# EAGLE design PDU_v3.0 (EAGLE 9.6.2)

## Sheet 1 of 11: PC104 Header
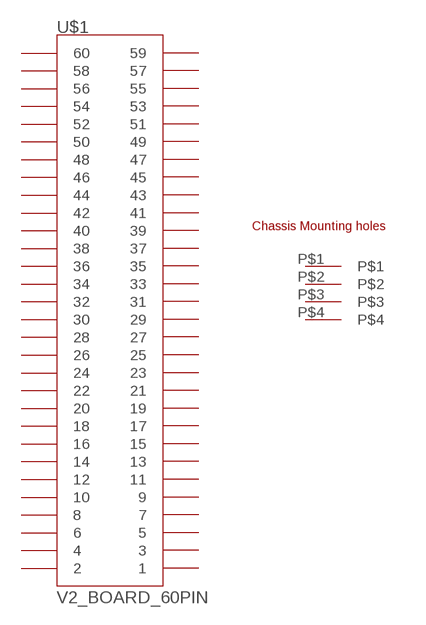
[diagram p0: schematic, sheet 1]

### Parts
U$1  V2_BOARD_60PIN  [PC104_WCONN_BACKPLANE_HEADER]
Unconnected: U$1.1 U$1.2 U$1.3 U$1.4 U$1.5 U$1.6 U$1.7 U$1.8 U$1.9 U$1.10 U$1.11 U$1.12 U$1.13 U$1.14 U$1.15 U$1.16 U$1.17 U$1.18 U$1.19 U$1.20 U$1.21 U$1.22 U$1.23 U$1.24 U$1.25 U$1.26 U$1.27 U$1.28 U$1.29 U$1.30 U$1.31 U$1.32 U$1.33 U$1.34 U$1.35 U$1.36 U$1.37 U$1.38 U$1.39 U$1.40 U$1.41 U$1.42 U$1.43 U$1.44 U$1.45 U$1.46 U$1.47 U$1.48 U$1.49 U$1.50 U$1.51 U$1.52 U$1.53 U$1.54 U$1.55 U$1.56 U$1.57 U$1.58 U$1.59 U$1.60 U$1.P$1 U$1.P$2 U$1.P$3 U$1.P$4

## Sheet 2 of 11: Connectors

## Sheet 3 of 11: H-Bridge Circuits
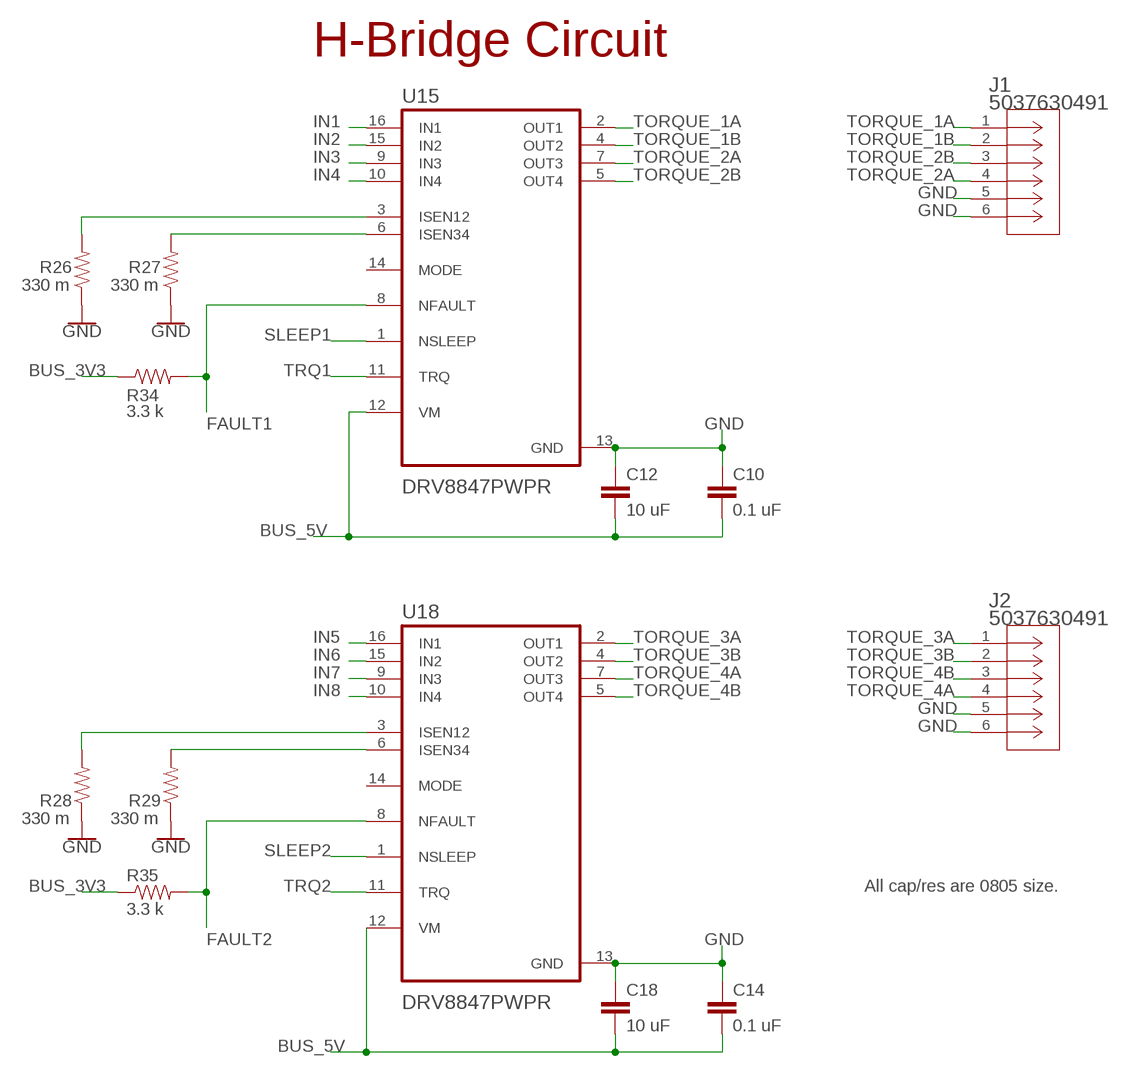
[diagram p1: schematic, sheet 3]

### Parts
C10  0.1 uF  CAP0805  [0805]
C12  10 uF  CAP0805  [0805]
C14  0.1 uF  CAP0805  [0805]
C18  10 uF  CAP0805  [0805]
J1  5037630491  [CON_5037630491]
J2  5037630491  [CON_5037630491]
R26  330 m  RESISTOR0805-RES  [0805]
R27  330 m  RESISTOR0805-RES  [0805]
R28  330 m  RESISTOR0805-RES  [0805]
R29  330 m  RESISTOR0805-RES  [0805]
R34  3.3 k  RESISTOR0805-RES  [0805]
R35  3.3 k  RESISTOR0805-RES  [0805]
U15  DRV8847PWPR  [SOP65P640X120-17N]
U18  DRV8847PWPR  [SOP65P640X120-17N]

### Nets
BUS_3V3: R34.1 R35.1 ; also sheet 4,6,8
BUS_5V: C10.2 C12.2 C14.2 C18.2 U15.12(VM) U18.12(VM) ; also sheet 4,6
FAULT1: R34.2 U15.8(NFAULT) ; also sheet 8
FAULT2: R35.2 U18.8(NFAULT) ; also sheet 8
GND: C10.1 C12.1 C14.1 C18.1 J1.5 J1.6 J2.5 J2.6 R26.1 R27.1 R28.1 R29.1 U15.13(GND) U18.13(GND) ; also sheet 4,5,6,7,8,9
IN1: U15.16(IN1) ; also sheet 8
IN2: U15.15(IN2) ; also sheet 8
IN3: U15.9(IN3) ; also sheet 8
IN4: U15.10(IN4) ; also sheet 8
IN5: U18.16(IN1) ; also sheet 8
IN6: U18.15(IN2) ; also sheet 8
IN7: U18.9(IN3) ; also sheet 8
IN8: U18.10(IN4) ; also sheet 8
N$20: R27.2 U15.6(ISEN34)
N$26: R26.2 U15.3(ISEN12)
N$30: R29.2 U18.6(ISEN34)
N$31: R28.2 U18.3(ISEN12)
SLEEP1: U15.1(NSLEEP) ; also sheet 8
SLEEP2: U18.1(NSLEEP) ; also sheet 8
TORQUE_1A: J1.1 U15.2(OUT1)
TORQUE_1B: J1.2 U15.4(OUT2)
TORQUE_2A: J1.4 U15.7(OUT3)
TORQUE_2B: J1.3 U15.5(OUT4)
TORQUE_3A: J2.1 U18.2(OUT1)
TORQUE_3B: J2.2 U18.4(OUT2)
TORQUE_4A: J2.4 U18.7(OUT3)
TORQUE_4B: J2.3 U18.5(OUT4)
TRQ1: U15.11(TRQ) ; also sheet 8
TRQ2: U18.11(TRQ) ; also sheet 8
Unconnected: U15.14(MODE) U18.14(MODE)

### Notes on the sheet
- H-Bridge Circuit
- All cap/res are 0805 size.

## Sheet 4 of 11: Switches 1
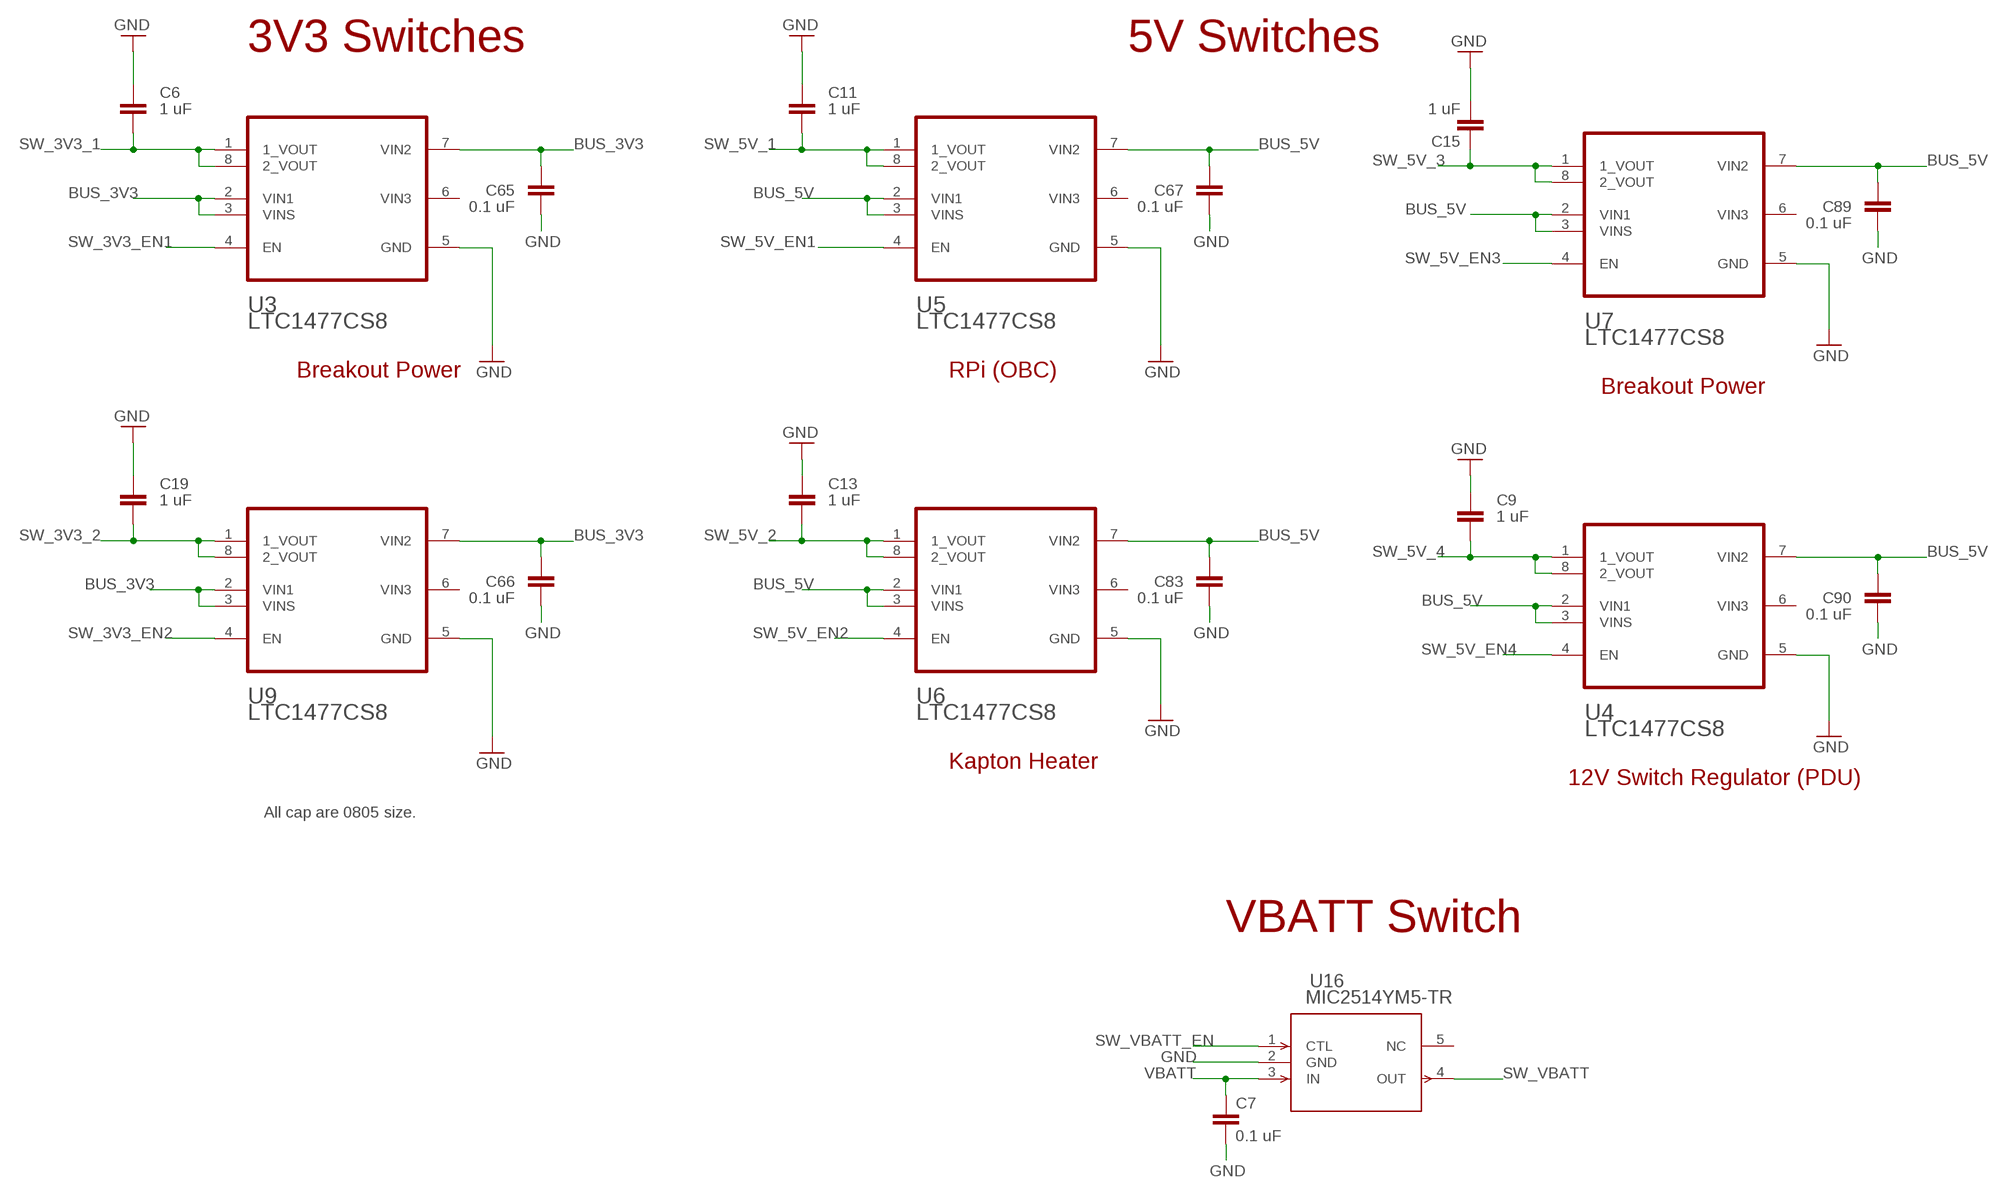
[diagram p2: schematic, sheet 4]

### Parts
C6  1 uF  CAP0805  [0805]
C7  0.1 uF  CAP0805  [0805]
C9  1 uF  CAP0805  [0805]
C11  1 uF  CAP0805  [0805]
C13  1 uF  CAP0805  [0805]
C15  1 uF  CAP0805  [0805]
C19  1 uF  CAP0805  [0805]
C65  0.1 uF  CAP0805  [0805]
C66  0.1 uF  CAP0805  [0805]
C67  0.1 uF  CAP0805  [0805]
C83  0.1 uF  CAP0805  [0805]
C89  0.1 uF  CAP0805  [0805]
C90  0.1 uF  CAP0805  [0805]
U3  LTC1477CS8LINEAR_TECHNOLOGY_LTC1477CS8_0_2  [LINEAR_TECHNOLOGY_LTC1477CS8_2]
U4  LTC1477CS8LINEAR_TECHNOLOGY_LTC1477CS8_0_2  [LINEAR_TECHNOLOGY_LTC1477CS8_2]
U5  LTC1477CS8LINEAR_TECHNOLOGY_LTC1477CS8_0_2  [LINEAR_TECHNOLOGY_LTC1477CS8_2]
U6  LTC1477CS8LINEAR_TECHNOLOGY_LTC1477CS8_0_2  [LINEAR_TECHNOLOGY_LTC1477CS8_2]
U7  LTC1477CS8LINEAR_TECHNOLOGY_LTC1477CS8_0_2  [LINEAR_TECHNOLOGY_LTC1477CS8_2]
U9  LTC1477CS8LINEAR_TECHNOLOGY_LTC1477CS8_0_2  [LINEAR_TECHNOLOGY_LTC1477CS8_2]
U16  MIC2514YM5-TR  [SOT-23-5_M5_MCH]

### Nets
BUS_3V3: C65.1 C66.1 U3.2(VIN1) U3.3(VINS) U3.7(VIN2) U9.2(VIN1) U9.3(VINS) U9.7(VIN2) ; also sheet 3,6,8
BUS_5V: C67.1 C83.1 C89.1 C90.1 U4.2(VIN1) U4.3(VINS) U4.7(VIN2) U5.2(VIN1) U5.3(VINS) U5.7(VIN2) U6.2(VIN1) U6.3(VINS) U6.7(VIN2) U7.2(VIN1) U7.3(VINS) U7.7(VIN2) ; also sheet 3,6
GND: C6.2 C7.2 C9.2 C11.2 C13.2 C15.2 C19.2 C65.2 C66.2 C67.2 C83.2 C89.2 C90.2 U3.5(GND) U4.5(GND) U5.5(GND) U6.5(GND) U7.5(GND) U9.5(GND) U16.2(GND) ; also sheet 3,5,6,7,8,9
SW_3V3_1: C6.1 U3.1(1_VOUT) U3.8(2_VOUT)
SW_3V3_2: C19.1 U9.1(1_VOUT) U9.8(2_VOUT)
SW_3V3_EN1: U3.4(EN) ; also sheet 8
SW_3V3_EN2: U9.4(EN) ; also sheet 8
SW_5V_1: C11.1 U5.1(1_VOUT) U5.8(2_VOUT)
SW_5V_2: C13.1 U6.1(1_VOUT) U6.8(2_VOUT)
SW_5V_3: C15.1 U7.1(1_VOUT) U7.8(2_VOUT)
SW_5V_4: C9.1 U4.1(1_VOUT) U4.8(2_VOUT) ; also sheet 5
SW_5V_EN1: U5.4(EN) ; also sheet 8
SW_5V_EN2: U6.4(EN) ; also sheet 8
SW_5V_EN3: U7.4(EN) ; also sheet 8
SW_5V_EN4: U4.4(EN) ; also sheet 8
SW_VBATT: U16.4(OUT)
SW_VBATT_EN: U16.1(CTL) ; also sheet 8
VBATT: C7.1 U16.3(IN) ; also sheet 6,7,8
Unconnected: U16.5(NC)

### Notes on the sheet
- 3V3 Switches | 5V Switches
- Breakout Power | RPi (OBC)
- Breakout Power
- Kapton Heater
- 12V Switch Regulator (PDU)
- All cap are 0805 size.
- VBATT Switch
- Switches (3V3, 5V, VBATT)

## Sheet 5 of 11: Switches 2
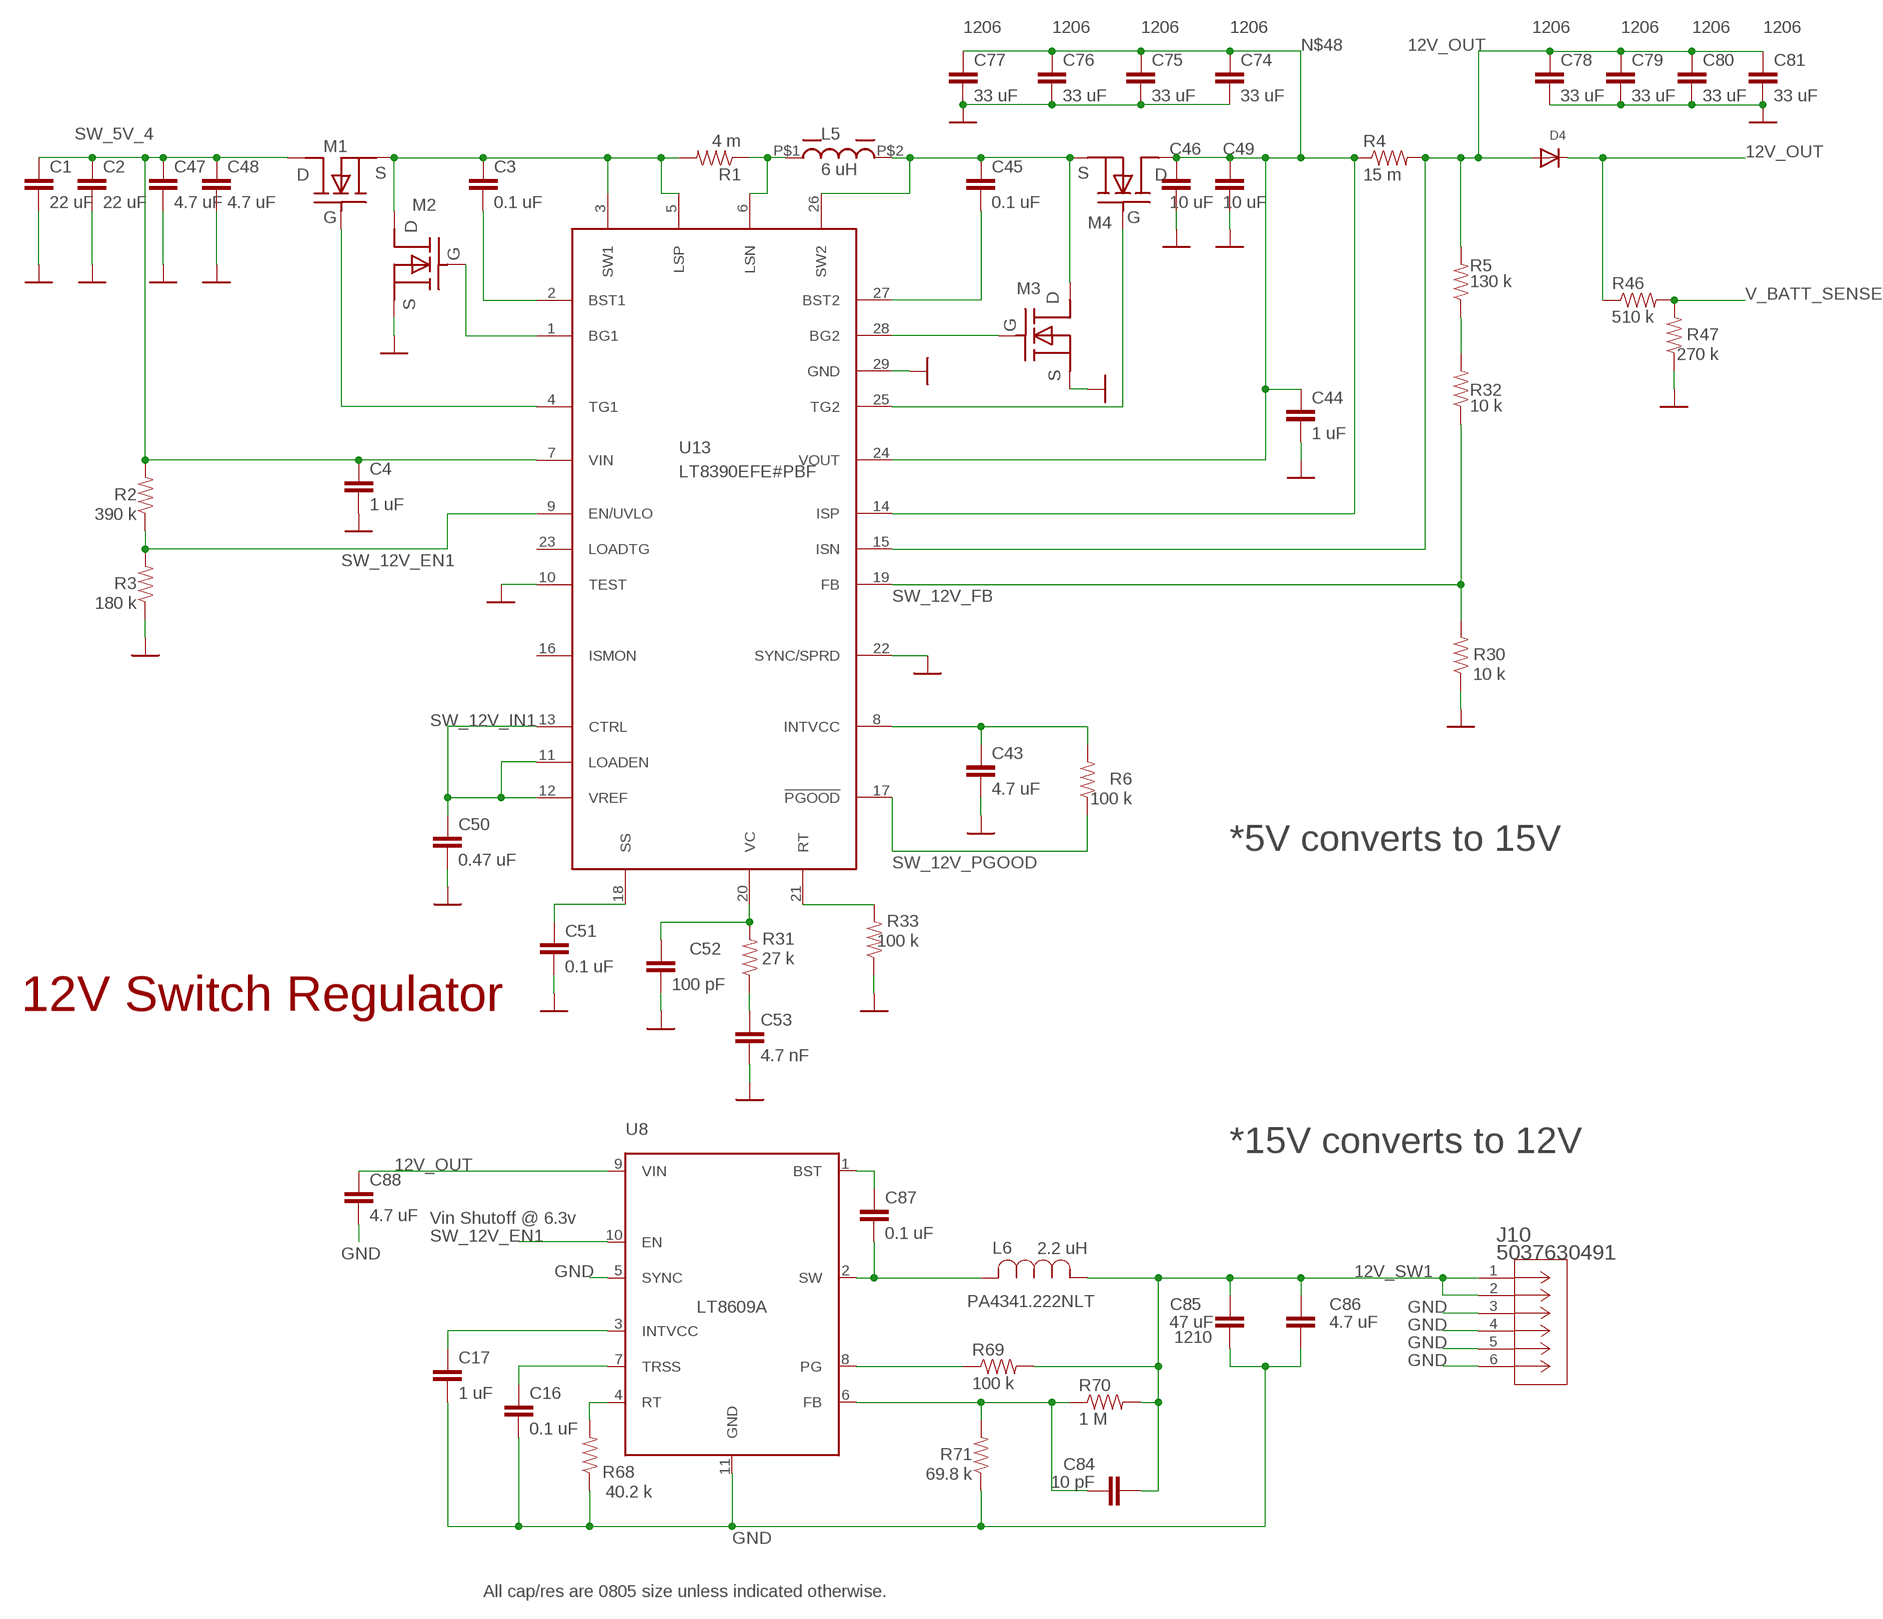
[diagram p3: schematic, sheet 5]

### Parts
C1  22 uF  CAP0805  [0805]
C2  22 uF  CAP0805  [0805]
C3  0.1 uF  CAP0805  [0805]
C4  1 uF  CAP0805  [0805]
C16  0.1 uF  CAP0805  [0805]
C17  1 uF  CAP0805  [0805]
C43  4.7 uF  CAP0805  [0805]
C44  1 uF  CAP0805  [0805]
C45  0.1 uF  CAP0805  [0805]
C46  10 uF  CAP0805  [0805]
C47  4.7 uF  CAP0805  [0805]
C48  4.7 uF  CAP0805  [0805]
C49  10 uF  CAP0805  [0805]
C50  0.47 uF  CAP0805  [0805]
C51  0.1 uF  CAP0805  [0805]
C52  100 pF  CAP0805  [0805]
C53  4.7 nF  CAP0805  [0805]
C74  33 uF  CAP1206  [1206]
C75  33 uF  CAP1206  [1206]
C76  33 uF  CAP1206  [1206]
C77  33 uF  CAP1206  [1206]
C78  33 uF  CAP1206  [1206]
C79  33 uF  CAP1206  [1206]
C80  33 uF  CAP1206  [1206]
C81  33 uF  CAP1206  [1206]
C84  10 pF  CAP0805  [0805]
C85  47 uF  CAP1210  [1210]
C86  4.7 uF  CAP0805  [0805]
C87  0.1 uF  CAP0805  [0805]
C88  4.7 uF  CAP0805  [0805]
D4  DIODE_SOD-123FL  [SOD-123FL]
J10  5037630491  [CON_5037630491]
L5  6 uH  7443551600  [7443551600]
L6  PA4341.222NLT  [IND_222NLT_PUL]
M1  BSZ100N06LS3  [BSZ100N06LS3]
M2  BSZ100N06LS3  [BSZ100N06LS3]
M3  BSZ033NE2LS5  BSZ100N06LS3  [BSZ100N06LS3]
M4  BSZ033NE2LS5  BSZ100N06LS3  [BSZ100N06LS3]
R1  4 m  RESISTOR0805-RES  [0805]
R2  390 k  RESISTOR0805-RES  [0805]
R3  180 k  RESISTOR0805-RES  [0805]
R4  15 m  RESISTOR0805-RES  [0805]
R5  130 k  RESISTOR0805-RES  [0805]
R6  100 k  RESISTOR0805-RES  [0805]
R30  10 k  RESISTOR0805-RES  [0805]
R31  27 k  RESISTOR0805-RES  [0805]
R32  10 k  RESISTOR0805-RES  [0805]
R33  100 k  RESISTOR0805-RES  [0805]
R46  510 k  RESISTOR0805-RES  [0805]
R47  270 k  RESISTOR0805-RES  [0805]
R68  40.2 k  RESISTOR0805-RES  [0805]
R69  100 k  RESISTOR0805-RES  [0805]
R70  1 M  RESISTOR0805-RES  [0805]
R71  69.8 k  RESISTOR0805-RES  [0805]
U8  LT8609A  [MSOP-10_MSE]
U13  LT8390EFE#PBF  [SOP65P640X120-29N]

### Nets
12V_OUT: C78.1 C79.1 C80.1 C81.1 C88.1 D4.A D4.C R4.2 R5.2 R46.1 U8.9(VIN) U13.15(ISN)
12V_SW1: C84.2 C85.1 C86.1 J10.1 J10.2 L6.1 R69.2 R70.2
BST_3V3_BUS: C87.1 U8.1(BST)
FB_3V3_BUS: C84.1 R70.1 R71.2 U8.6(FB)
GND: C1.2 C2.2 C4.2 C16.2 C17.2 C43.2 C44.2 C46.2 C47.2 C48.2 C49.2 C50.2 C51.2 C52.2 C53.2 C74.2 C75.2 C76.2 C77.2 C78.2 C79.2 C80.2 C81.2 C85.2 C86.2 C88.2 J10.3 J10.4 J10.5 J10.6 M2.P$2(S) M2.P$3(S) M2.P$4(S) M3.P$2(S) M3.P$3(S) M3.P$4(S) R3.1 R30.1 R33.1 R47.1 R68.1 R71.1 U8.5(SYNC) U8.11(GND) U13.10(TEST) U13.22(SYNC/SPRD) U13.29(GND) ; also sheet 3,4,6,7,8,9
N$1: C3.1 M1.P$2(S) M1.P$3(S) M1.P$4(S) M2.P$5(D) M2.P$6(D) M2.P$7(D) M2.P$8(D) M2.P$9(D) R1.2 U13.3(SW1) U13.5(LSP)
N$2: C3.2 U13.2(BST1)
N$3: M2.P$1(G) U13.1(BG1)
N$4: M1.P$1(G) U13.4(TG1)
N$6: M3.P$1(G) U13.28(BG2)
N$38: C52.1 R31.2 U13.20(VC)
N$40: R5.1 R32.2
N$41: C45.1 L5.P$2 M3.P$5(D) M3.P$6(D) M3.P$7(D) M3.P$8(D) M3.P$9(D) M4.P$2(S) M4.P$3(S) M4.P$4(S) U13.26(SW2)
N$44: C43.1 R6.2 U13.8(INTVCC)
N$45: L5.P$1 R1.1 U13.6(LSN)
N$47: C45.2 U13.27(BST2)
N$48: C44.1 C46.1 C49.1 C74.1 C75.1 C76.1 C77.1 M4.P$5(D) M4.P$6(D) M4.P$7(D) M4.P$8(D) M4.P$9(D) R4.1 U13.14(ISP) U13.24(VOUT)
N$49: M4.P$1(G) U13.25(TG2)
N$50: C51.1 U13.18(SS)
N$52: R33.2 U13.21(RT)
N$55: C53.1 R31.1
PG_3V3_BUS: R69.1 U8.8(PG)
RT_3V3_BUS: R68.2 U8.4(RT)
SW_3V3_BUS: C87.2 L6.2 U8.2(SW)
SW_5V_4: C1.1 C2.1 C4.1 C47.1 C48.1 M1.P$5(D) M1.P$6(D) M1.P$7(D) M1.P$8(D) M1.P$9(D) R2.2 U13.7(VIN) ; also sheet 4
SW_12V_EN1: R2.1 R3.2 U8.10(EN) U13.9(EN/UVLO)
SW_12V_FB: R30.2 R32.1 U13.19(FB)
SW_12V_IN1: C50.1 U13.11(LOADEN) U13.12(VREF) U13.13(CTRL)
SW_12V_PGOOD: R6.1 U13.17(!PGOOD)
TRSS_3V3_BUS: C16.1 U8.7(TRSS)
V_BATT_SENSE: R46.2 R47.2
VCC_3V3_BUS: C17.1 U8.3(INTVCC)
Unconnected: U13.16(ISMON) U13.23(LOADTG)

### Notes on the sheet
- 1206 | 1206 | 1206 | 1206 | 1206 | 1206 | 1206 | 1206
- 6 uH
- *5V converts to 15V
- 12V Switch Regulator
- *15V converts to 12V
- Vin Shutoff @ 6.3v
- 2.2 uH
- 1210
- All cap/res are 0805 size unless indicated otherwise.

## Sheet 6 of 11: Bus (3V3, 5V)
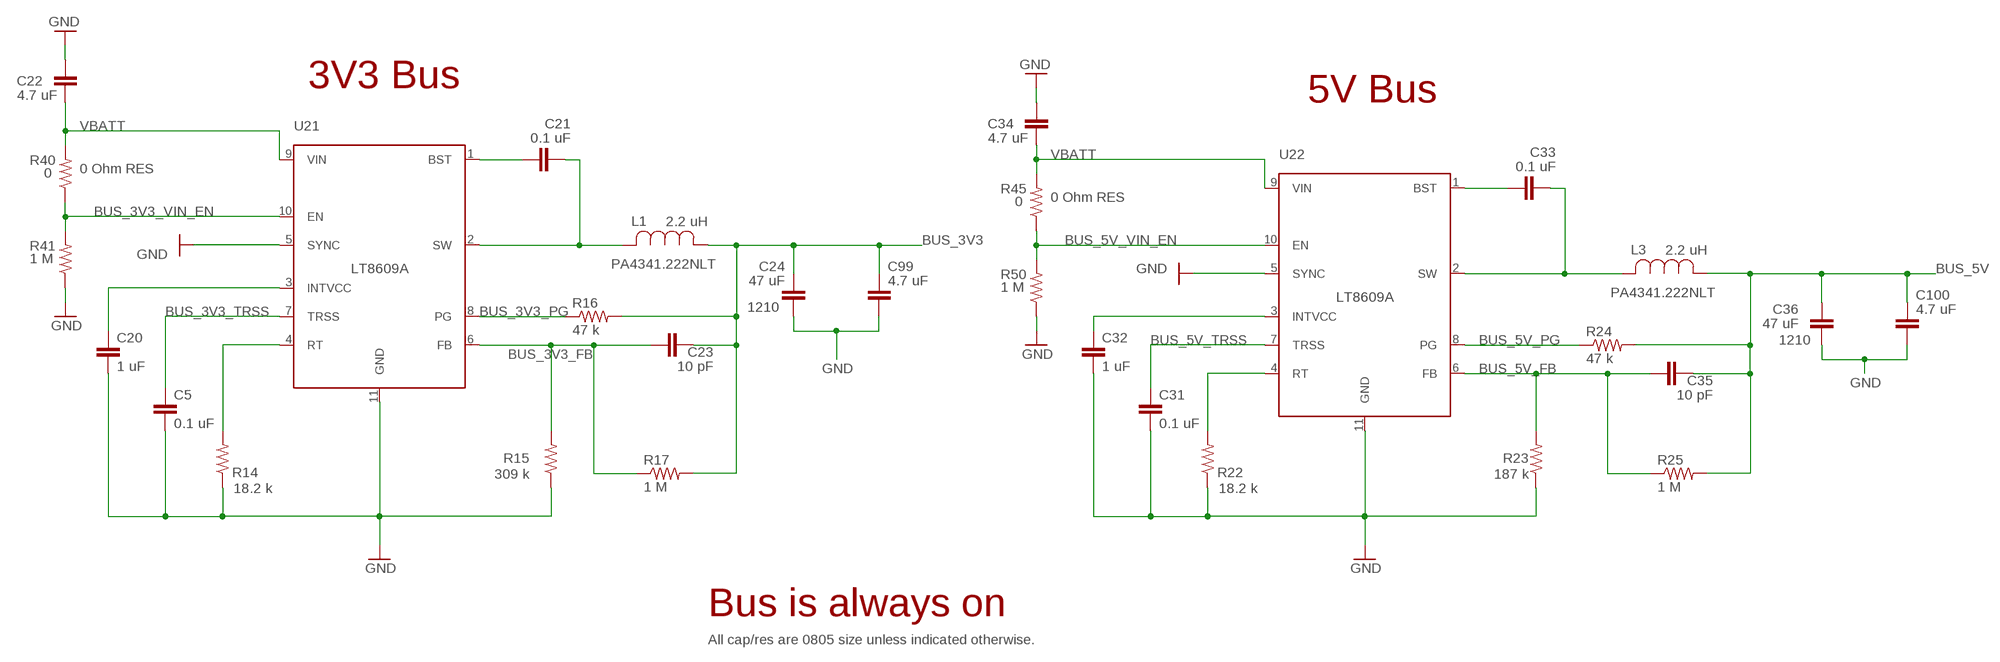
[diagram p4: schematic, sheet 6]

### Parts
C5  0.1 uF  CAP0805  [0805]
C20  1 uF  CAP0805  [0805]
C21  0.1 uF  CAP0805  [0805]
C22  4.7 uF  CAP0805  [0805]
C23  10 pF  CAP0805  [0805]
C24  47 uF  CAP1210  [1210]
C31  0.1 uF  CAP0805  [0805]
C32  1 uF  CAP0805  [0805]
C33  0.1 uF  CAP0805  [0805]
C34  4.7 uF  CAP0805  [0805]
C35  10 pF  CAP0805  [0805]
C36  47 uF  CAP1210  [1210]
C99  4.7 uF  CAP0805  [0805]
C100  4.7 uF  CAP0805  [0805]
L1  PA4341.222NLT  [IND_222NLT_PUL]
L3  PA4341.222NLT  [IND_222NLT_PUL]
R14  18.2 k  RESISTOR0805-RES  [0805]
R15  309 k  RESISTOR0805-RES  [0805]
R16  47 k  RESISTOR0805-RES  [0805]
R17  1 M  RESISTOR0805-RES  [0805]
R22  18.2 k  RESISTOR0805-RES  [0805]
R23  187 k  RESISTOR0805-RES  [0805]
R24  47 k  RESISTOR0805-RES  [0805]
R25  1 M  RESISTOR0805-RES  [0805]
R40  0  RESISTOR0805-RES  [0805]
R41  1 M  RESISTOR0805-RES  [0805]
R45  0  RESISTOR0805-RES  [0805]
R50  1 M  RESISTOR0805-RES  [0805]
U21  LT8609A  [MSOP-10_MSE]
U22  LT8609A  [MSOP-10_MSE]

### Nets
BUS_3V3: C23.2 C24.1 C99.1 L1.1 R16.2 R17.2 ; also sheet 3,4,8
BUS_3V3_FB: C23.1 R15.2 R17.1 U21.6(FB)
BUS_3V3_PG: R16.1 U21.8(PG)
BUS_3V3_TRSS: C5.1 U21.7(TRSS)
BUS_3V3_VIN_EN: R40.1 R41.2 U21.10(EN)
BUS_5V: C35.2 C36.1 C100.1 L3.1 R24.2 R25.2 ; also sheet 3,4
BUS_5V_FB: C35.1 R23.2 R25.1 U22.6(FB)
BUS_5V_PG: R24.1 U22.8(PG)
BUS_5V_TRSS: C31.1 U22.7(TRSS)
BUS_5V_VIN_EN: R45.1 R50.2 U22.10(EN)
GND: C5.2 C20.2 C22.2 C24.2 C31.2 C32.2 C34.2 C36.2 C99.2 C100.2 R14.1 R15.1 R22.1 R23.1 R41.1 R50.1 U21.5(SYNC) U21.11(GND) U22.5(SYNC) U22.11(GND) ; also sheet 3,4,5,7,8,9
N$7: C20.1 U21.3(INTVCC)
N$8: R14.2 U21.4(RT)
N$11: C21.1 U21.1(BST)
N$12: C21.2 L1.2 U21.2(SW)
N$25: R22.2 U22.4(RT)
N$27: C32.1 U22.3(INTVCC)
N$28: C33.1 U22.1(BST)
N$29: C33.2 L3.2 U22.2(SW)
VBATT: C22.1 C34.1 R40.2 R45.2 U21.9(VIN) U22.9(VIN) ; also sheet 4,7,8

### Notes on the sheet
- 3V3 Bus
- 5V Bus
- 0 Ohm RES
- 0 Ohm RES
- 2.2 uH
- 2.2 uH
- 1210
- 1210
- Bus is always on
- All cap/res are 0805 size unless indicated otherwise.

## Sheet 7 of 11: 5V Burn
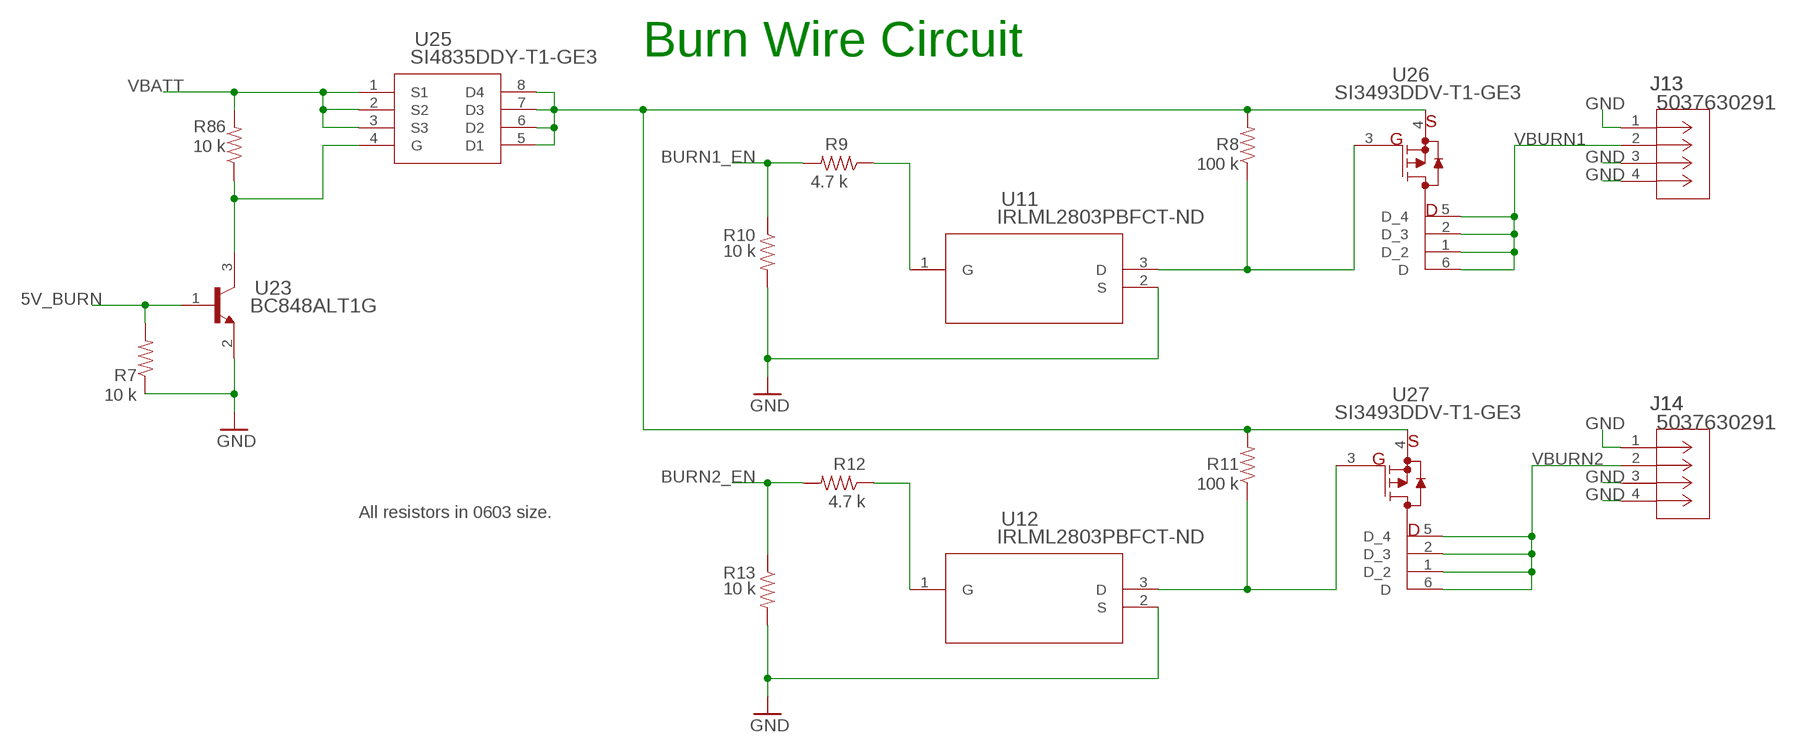
[diagram p5: schematic, sheet 7]

### Parts
J13  5037630291  [CON_5037630291]
J14  5037630291  [CON_5037630291]
R7  10 k  RESISTOR0603-RES  [0603-RES]
R8  100 k  RESISTOR0603-RES  [0603-RES]
R9  4.7 k  RESISTOR0603-RES  [0603-RES]
R10  10 k  RESISTOR0603-RES  [0603-RES]
R11  100 k  RESISTOR0603-RES  [0603-RES]
R12  4.7 k  RESISTOR0603-RES  [0603-RES]
R13  10 k  RESISTOR0603-RES  [0603-RES]
R86  10 k  RESISTOR0603-RES  [0603-RES]
U11  IRLML2803PBFCT-ND  [PG-TO23-3_INF]
U12  IRLML2803PBFCT-ND  [PG-TO23-3_INF]
U23  BC848ALT1G  [SOT-23_ONS]
U25  SI4835DDY-T1-GE3  [SOIC_DY-T1-GE3_VIS]
U26  SI3493DDV-T1-GE3  [6TSOP_VIS]
U27  SI3493DDV-T1-GE3  [6TSOP_VIS]

### Nets
5V_BURN: R7.2 U23.1(BASE) ; also sheet 8
BURN1_EN: R9.2 R10.1 ; also sheet 8
BURN2_EN: R12.2 R13.1 ; also sheet 8
GND: J13.1 J13.3 J13.4 J14.1 J14.3 J14.4 R7.1 R10.2 R13.2 U11.2(S) U12.2(S) U23.2(EMITTER) ; also sheet 3,4,5,6,8,9
N$13: R8.2 R11.2 U25.5(D1) U25.6(D2) U25.7(D3) U25.8(D4) U26.4(S) U27.4(S)
N$14: R12.1 U12.1(G)
N$15: R11.1 U12.3(D) U27.3(G)
N$16: R86.1 U23.3(COLLECTOR) U25.4(G)
N$17: R9.1 U11.1(G)
N$18: R8.1 U11.3(D) U26.3(G)
VBATT: R86.2 U25.1(S1) U25.2(S2) U25.3(S3) ; also sheet 4,6,8
VBURN1: J13.2 U26.1(D_2) U26.2(D_3) U26.5(D_4) U26.6(D)
VBURN2: J14.2 U27.1(D_2) U27.2(D_3) U27.5(D_4) U27.6(D)

### Notes on the sheet
- Burn Wire Circuit
- All resistors in 0603 size.

## Sheet 8 of 11: Microprocessor
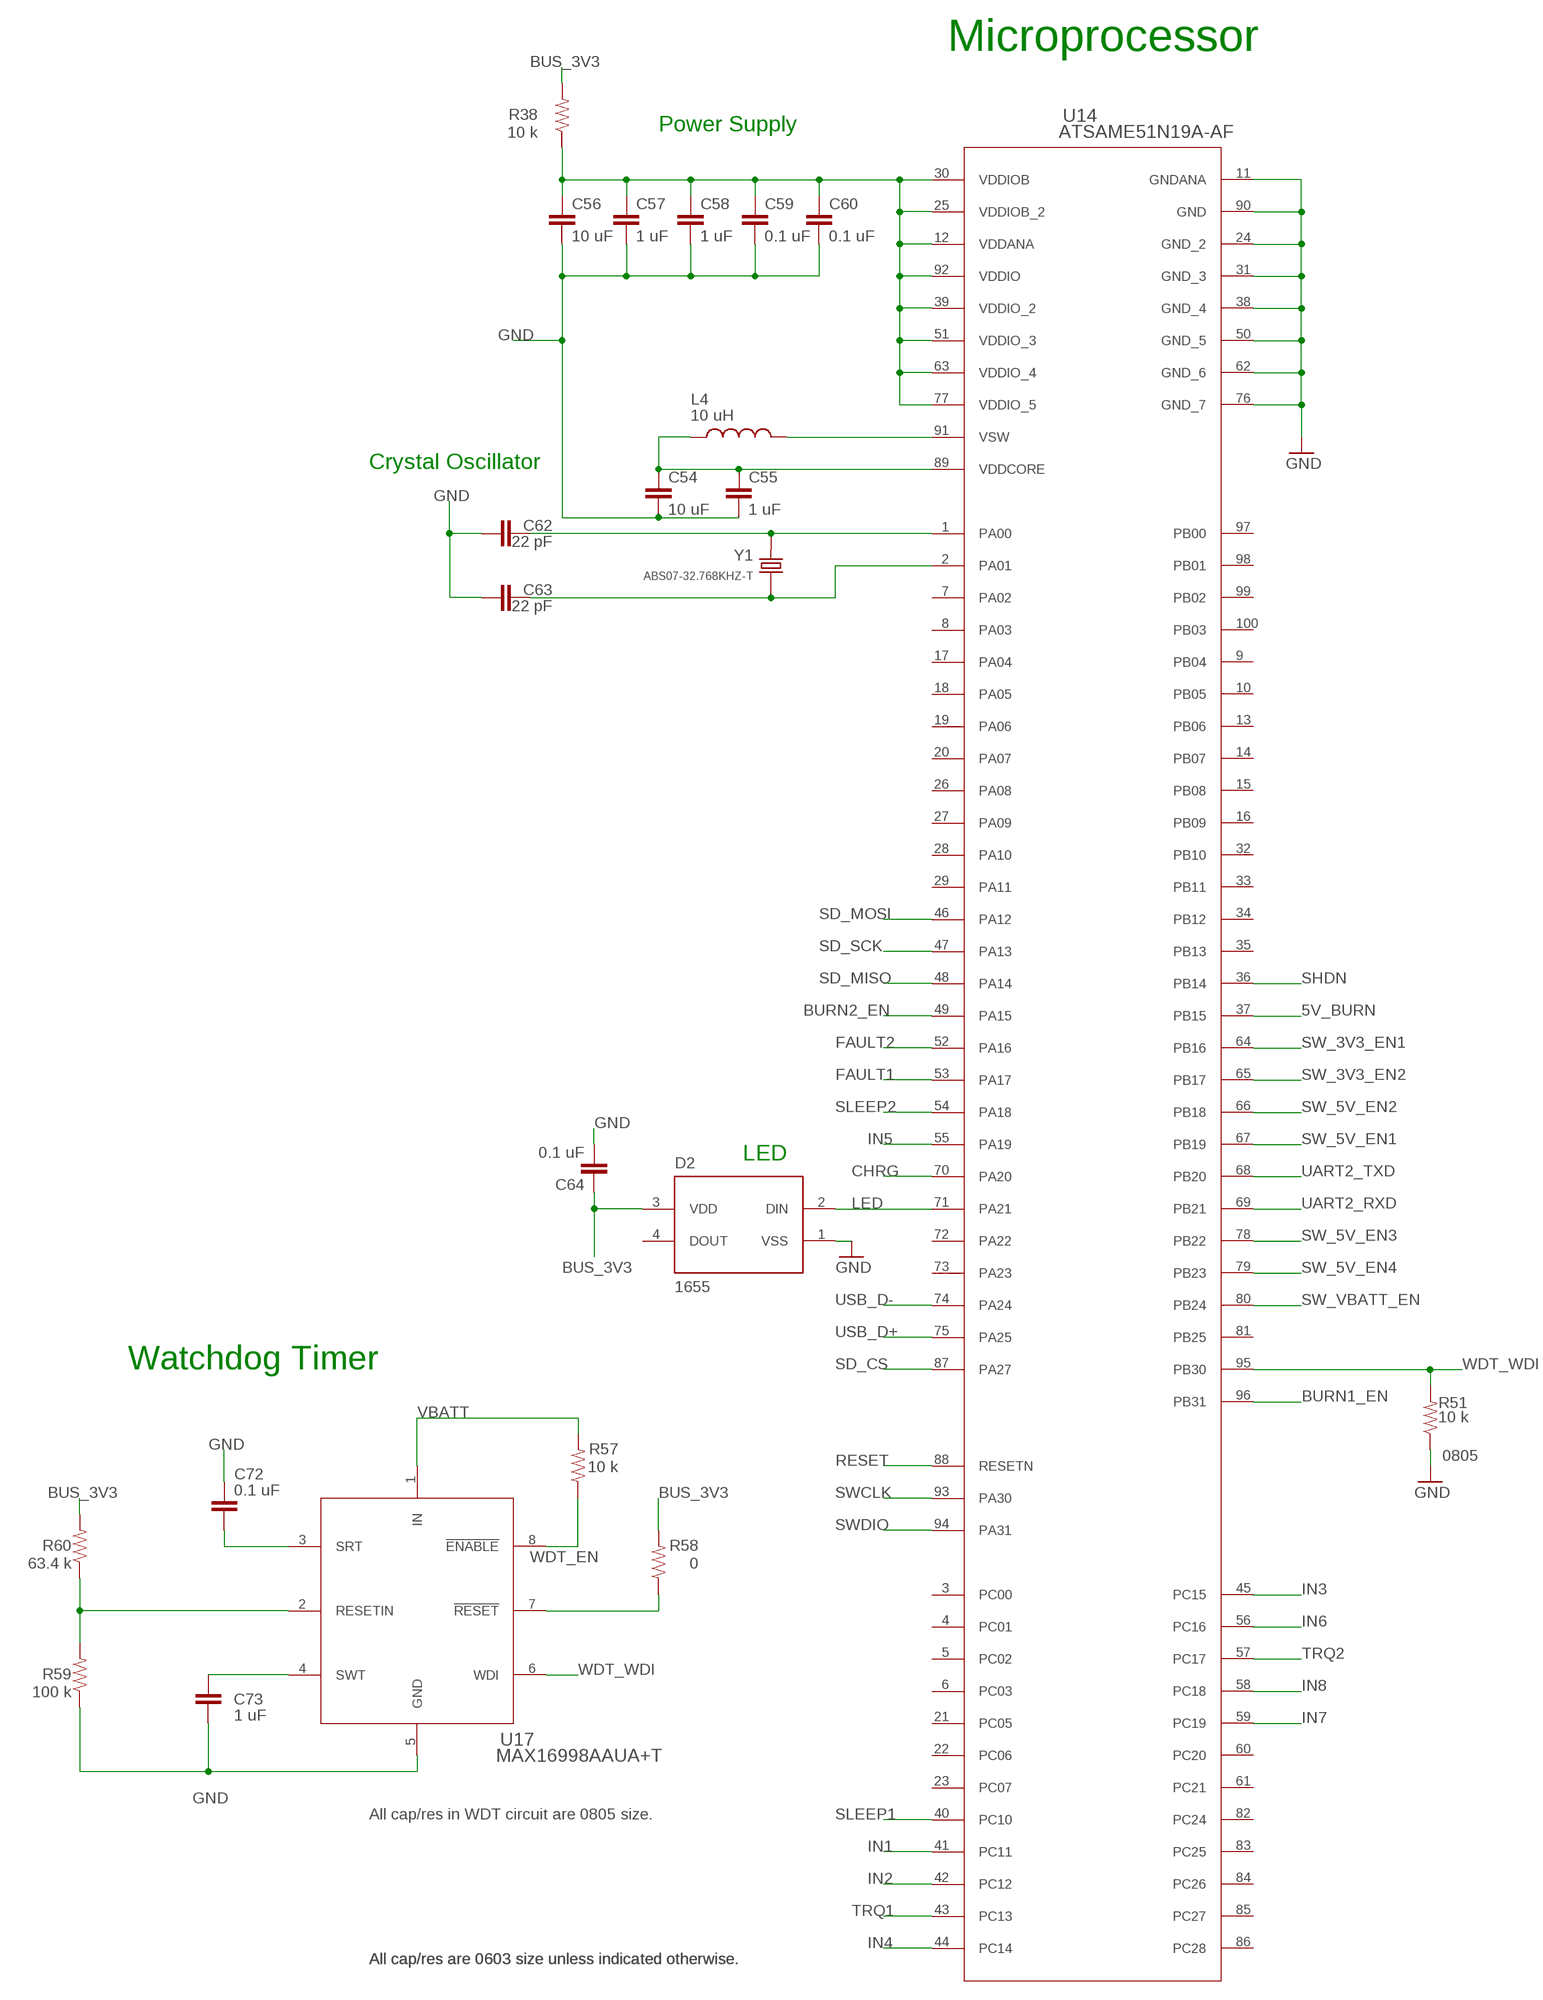
[diagram p6: schematic, sheet 8]

### Parts
C54  10 uF  CAP0603-CAP  [0603-CAP]
C55  1 uF  CAP0603-CAP  [0603-CAP]
C56  10 uF  CAP0603-CAP  [0603-CAP]
C57  1 uF  CAP0603-CAP  [0603-CAP]
C58  1 uF  CAP0603-CAP  [0603-CAP]
C59  0.1 uF  CAP0603-CAP  [0603-CAP]
C60  0.1 uF  CAP0603-CAP  [0603-CAP]
C62  22 pF  CAP0603-CAP  [0603-CAP]
C63  22 pF  CAP0603-CAP  [0603-CAP]
C64  0.1 uF  CAP0603-CAP  [0603-CAP]
C72  0.1 uF  CAP0805  [0805]
C73  1 uF  CAP0805  [0805]
D2  1655  [LED_1655]
L4  10 uH  CBL2012T100M  [INDC2012X100N]
R38  10 k  RESISTOR0603-RES  [0603-RES]
R51  10 k  RESISTOR0805-RES  [0805]
R57  10 k  RESISTOR0805-RES  [0805]
R58  0  RESISTOR0805-RES  [0805]
R59  100 k  RESISTOR0805-RES  [0805]
R60  63.4 k  RESISTOR0805-RES  [0805]
U14  ATSAME51N19A-AF  [TQFP100_14X14MC_MCH]
U17  MAX16998AAUA+T  [21-0036K_MXM]
Y1  ABS07-32.768KHZ-T  [XTAL_ABS07-32.768KHZ-T]

### Nets
5V_BURN: U14.37(PB15) ; also sheet 7
BURN1_EN: U14.96(PB31) ; also sheet 7
BURN2_EN: U14.49(PA15) ; also sheet 7
BUS_3V3: C64.1 D2.3(VDD) R38.2 R58.2 R60.2 ; also sheet 3,4,6
CCO_0: C62.2 U14.1(PA00) Y1.2
CCO_1: C63.2 U14.2(PA01) Y1.1
CHRG: U14.70(PA20)
FAULT1: U14.53(PA17) ; also sheet 3
FAULT2: U14.52(PA16) ; also sheet 3
GND: C54.2 C55.2 C56.2 C57.2 C58.2 C59.2 C60.2 C62.1 C63.1 C64.2 C72.1 C73.2 D2.1(VSS) R51.1 R59.1 U14.11(GNDANA) U14.24(GND_2) U14.31(GND_3) U14.38(GND_4) U14.50(GND_5) U14.62(GND_6) U14.76(GND_7) U14.90(GND) U17.5(GND) ; also sheet 3,4,5,6,7,9
IN1: U14.41(PC11) ; also sheet 3
IN2: U14.42(PC12) ; also sheet 3
IN3: U14.45(PC15) ; also sheet 3
IN4: U14.44(PC14) ; also sheet 3
IN5: U14.55(PA19) ; also sheet 3
IN6: U14.56(PC16) ; also sheet 3
IN7: U14.59(PC19) ; also sheet 3
IN8: U14.58(PC18) ; also sheet 3
LED: D2.2(DIN) U14.71(PA21)
N$46: L4.2 U14.91(VSW)
N$58: C54.1 C55.1 L4.1 U14.89(VDDCORE)
N$66: C72.2 U17.3(SRT)
N$68: C73.1 U17.4(SWT)
N$70: R59.2 R60.1 U17.2(RESETIN)
RESET: R58.1 U14.88(RESETN) U17.7(!RESET)
SD_CS: U14.87(PA27)
SD_MISO: U14.48(PA14)
SD_MOSI: U14.46(PA12)
SD_SCK: U14.47(PA13)
SHDN: U14.36(PB14)
SLEEP1: U14.40(PC10) ; also sheet 3
SLEEP2: U14.54(PA18) ; also sheet 3
SW_3V3_EN1: U14.64(PB16) ; also sheet 4
SW_3V3_EN2: U14.65(PB17) ; also sheet 4
SW_5V_EN1: U14.67(PB19) ; also sheet 4
SW_5V_EN2: U14.66(PB18) ; also sheet 4
SW_5V_EN3: U14.78(PB22) ; also sheet 4
SW_5V_EN4: U14.79(PB23) ; also sheet 4
SW_VBATT_EN: U14.80(PB24) ; also sheet 4
SWCLK: U14.93(PA30)
SWDIO: U14.94(PA31)
TRQ1: U14.43(PC13) ; also sheet 3
TRQ2: U14.57(PC17) ; also sheet 3
UART2_RXD: U14.69(PB21)
UART2_TXD: U14.68(PB20)
USB_D+: U14.75(PA25)
USB_D-: U14.74(PA24)
VBATT: R57.2 U17.1(IN) ; also sheet 4,6,7
VDD1: C56.1 C57.1 C58.1 C59.1 C60.1 R38.1 U14.12(VDDANA) U14.25(VDDIOB_2) U14.30(VDDIOB) U14.39(VDDIO_2) U14.51(VDDIO_3) U14.63(VDDIO_4) U14.77(VDDIO_5) U14.92(VDDIO)
WDT_EN: R57.1 U17.8(!ENABLE)
WDT_WDI: R51.2 U14.95(PB30) U17.6(WDI)
Unconnected: D2.4(DOUT) U14.3(PC00) U14.4(PC01) U14.5(PC02) U14.6(PC03) U14.7(PA02) U14.8(PA03) U14.9(PB04) U14.10(PB05) U14.13(PB06) U14.14(PB07) U14.15(PB08) U14.16(PB09) U14.17(PA04) U14.18(PA05) U14.19(PA06) U14.20(PA07) U14.21(PC05) U14.22(PC06) U14.23(PC07) U14.26(PA08) U14.27(PA09) U14.28(PA10) U14.29(PA11) U14.32(PB10) U14.33(PB11) U14.34(PB12) U14.35(PB13) U14.60(PC20) U14.61(PC21) U14.72(PA22) U14.73(PA23) U14.81(PB25) U14.82(PC24) U14.83(PC25) U14.84(PC26) U14.85(PC27) U14.86(PC28) U14.97(PB00) U14.98(PB01) U14.99(PB02) U14.100(PB03)

### Notes on the sheet
- Microprocessor
- Power Supply
- Crystal Oscillator
- LED
- Watchdog Timer
- 0805
- All cap/res in WDT circuit are 0805 size.
- All cap/res are 0603 size unless indicated otherwise. | All cap/res are 0603 size unless indicated otherwise.

## Sheet 9 of 11: Sensors (Current, Temperature)
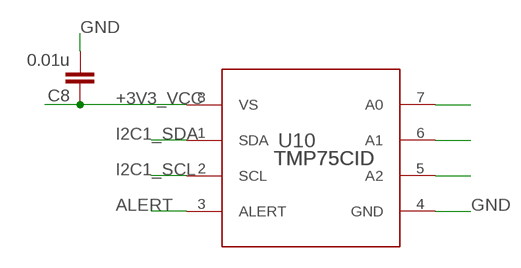
[diagram p7: schematic, sheet 9]

### Parts
C8  0.01u  CAP0805  [0805]
U10  TMP75CID  [D0008A_N]

### Nets
+3V3_VCC: C8.1 U10.8(VS)
ALERT: U10.3(ALERT)
GND: C8.2 U10.4(GND) ; also sheet 3,4,5,6,7,8
I2C1_SCL: U10.2(SCL)
I2C1_SDA: U10.1(SDA)
N$9: U10.5(A2)
N$10: U10.6(A1)
N$19: U10.7(A0)

## Sheet 10 of 11: Battery Charging

## Sheet 11 of 11

## Power pins joined to a net without a drawn wire
VIN3: U3.6(VIN3) U4.6(VIN3) U5.6(VIN3) U6.6(VIN3) U7.6(VIN3) U9.6(VIN3)

## Library data of the parts
C1-C7 C9-C24 C31-C36 C43-C60 C62-C67 C72-C81 C83-C90 C99 C100 = HSFL_Main_Library:CAP: Capacitor Standard 0603 ceramic capacitor, and 0.1" leaded capacitor.
C8 = HSFL_Main_Library (1):CAP: Capacitor Standard 0603 ceramic capacitor, and 0.1" leaded capacitor.
D2 = Artemis:1655: Ws2812b 5050 Rgb Led With Integrated Driver Chip Pack Of 10; DESCRIPTION: Ws2812b 5050 Rgb Led With Integrated Driver Chip Pack Of 10; MF: Adafruit; MP: 1655; PACKAGE: Adafruit
D4 = adafruit:DIODE: Diode SMADIODE - SMA Surface Mount Package 20V 1A Schottky Diode Digikey: 641-1014-6-ND DO-1N4148 - Through Hole Small Current Diode SOD-123 20V 1 A (.5mV Vf) Schottky Diode - Digikey: MBRX120TPMSCT-ND SOD-323 10V 570mA (.38mV Vf, 3ns) Schottky Diode - Digikey: ZLLS410CT-ND SOD-523 30V 30mA Schottky Diode (RB751S-40TE61) - Digikey: RB751S-40TE61CT-ND SOT23-R/W - SOT23 Package (R = Solder Paste/Reflow Ovens, W = Hand-Soldering) BAT54Film 40V 300mA - Digikey: 497-7162-1-ND
J1 J2 J10 = Artemis:5037630491; BUILT_BY: Molex_Team; COPYRIGHT: Copyright (C) 2018 Accelerated Designs. All rights reserved; MANUFACTURER_PART_NUMBER: 5037630491; SOURCELIBRARY: Add_to_database_2021-03-17; VENDOR: Molex Connector Corporation
J13 J14 = Artemis:5037630291; BUILT_BY: Molex_Team; COPYRIGHT: Copyright (C) 2018 Accelerated Designs. All rights reserved; MANUFACTURER_PART_NUMBER: 5037630291; SOURCELIBRARY: Add_to_database_2021-03-17; VENDOR: Molex Connector Corporation
L1 L3 L6 = Artemis:PA4341.222NLT; COPYRIGHT: Copyright (C) 2021 Ultra Librarian. All rights reserved.; DIGI-KEY_PART_NUMBER_1: 553-3409-2-ND; DIGI-KEY_PART_NUMBER_2: 553-3409-1-ND; DIGI-KEY_PART_NUMBER_3: 553-3409-6-ND; MANUFACTURER_PART_NUMBER: PA4341.222NLT; MFR_NAME: Pulse Electronics Corporation
L4 = Artemis:CBL2012T100M: Power Inductor; Inductor Type:Power; Series:CBL; Inductance:10µH; Inductance Tolerance:± 20%; DC Resistance Max:1.3ohm; DC Current Rating:205mA; Package/Case:0805; Current Rating:205mA; Leaded Process Compatible:Yes ;RoHS Compliant: Yes; DESCRIPTION: 10µH Unshielded Wirewound Inductor 370mA 1.3Ohm Max 0805 (2012 Metric); DIGI-KEY_PART_NUMBER: 587-1632-1-ND; MF: Taiyo Yuden; MP: CBL2012T100M; PACKAGE: 2012 Taiyo Yuden
L5 = HSFL_Main_Library:7443551600
M1-M4 = HSFL_Main_Library:BSZ100N06LS3
R1-R17 R22-R35 R38 R40 R41 R45-R47 R50 R51 R57-R60 R68-R71 R86 = HSFL_Main_Library:RESISTOR: Resistor Basic schematic elements and footprints for 0603, 1206, and PTH resistors.
U3-U7 U9 = Artemis:LTC1477CS8: LT-LTC1477-S8-8; CIIVA_IDS: 1432281; COMPONENT_LINK_1_DESCRIPTION: Manufacturer URL; COMPONENT_LINK_1_URL: http://www.linear.com/; COMPONENT_LINK_3_DESCRIPTION: Package Specification; COMPONENT_LINK_3_URL: http://cds.linear.com/docs/en/packaging/05081610_G_SO8.pdf; DATASHEET: http://cds.linear.com/docs/en/datasheet/lt1477.pdf; FOOTPRINT_VARIANT_NAME_0: Level C; FOOTPRINT_VARIANT_NAME_1: Level B; FOOTPRINT_VARIANT_NAME_2: Level A; IMPORTED: yes; IMPORTED_FROM: vault; IMPORT_TS: 1521843574; MF: Linear Technology; MOUNTING_TECHNOLOGY: Surface Mount; MPN: LTC1477CS8; PACKAGE: S8-8; PACKAGE_DESCRIPTION: 8-Pin Plastic Small Outline (Narrow .150 Inch), Body 4.9 x 3.9 mm, Pitch 1.27 mm; PACKAGE_VERSION: Rev. G, 03/2012; PREFIX: U; RELEASE_DATE: 1377817843; ROHS: No; VAULT_GUID: 635B2D7C-EC07-409E-A57F-666E02CD64AC; VAULT_REVISION: 6B8B57C2-2CB3-4970-A31A-1EB58B636423
U8 U21 U22 = HSFL_Main_Library:LT8609A
U10 = TMP75CID:TMP75CID; COPYRIGHT: Copyright (C) 2023 Ultra Librarian. All rights reserved.; MANUFACTURER_PART_NUMBER: TMP75CID; MFR_NAME: Texas Instruments; REFDES: RefDes; TYPE: TYPE
U11 U12 = Artemis:IRLML2803PBFCT-ND; BUILT_BY: EMA_UL_Team; COPYRIGHT: Copyright (C) 2018 Accelerated Designs. All rights reserved; MANUFACTURER_PART_NUMBER: IRLML2803PBFCT-ND; SOURCELIBRARY: Infineon_2019-12-20; VENDOR: Infineon
U13 = Artemis:LT8390EFE#PBF: DC/DC Cntrlr Single-OUT Step Down/Step Up 630kHz Automotive 28-Pin TSSOP EP Tube Check prices <https://pricing.snapeda.com/parts/LT8390EFE%23PBF/Analog%20Devices/view-part?ref=eda>; AVAILABILITY: No availability data; DESCRIPTION: DC/DC Cntrlr Single-OUT Step Down/Step Up 630kHz Automotive 28-Pin TSSOP EP Tube; MF: Analog Devices; MP: LT8390EFE#PBF; PACKAGE: TSSOP -28 Analog Devices; PRICE: None
U14 = Artemis:ATSAME51N19A-AF; BUILT_BY: EMA_Molly; COPYRIGHT: Copyright (C) 2018 Accelerated Designs. All rights reserved; MANUFACTURER_PART_NUMBER: ATSAME51N19A-AF; SOURCELIBRARY: Microchip_2019-08-23_25; VENDOR: Microchip
U15 U18 = Artemis:DRV8847PWPR: None Check prices <https://pricing.snapeda.com/parts/DRV8847PWPR/Texas%20Instruments/view-part?ref=eda>; AVAILABILITY: Warning; DESCRIPTION: 18-V, 2-A dual H-bridge motor driver with current regulation & independent half-bridge control 16-HTSSOP -40 to 125; MF: Texas Instruments; MP: DRV8847PWPR; PACKAGE: HTSSOP-16 Texas Instruments; PRICE: None; PURCHASE-URL: https://pricing.snapeda.com/search/part/DRV8847PWPR/?ref=eda
U16 = Artemis:MIC2514YM5-TR; COPYRIGHT: Copyright (C) 2021 Ultra Librarian. All rights reserved.; DIGI-KEY_PART_NUMBER_1: 576-1085-1-ND; DIGI-KEY_PART_NUMBER_2: 576-1085-2-ND; DIGI-KEY_PART_NUMBER_3: 576-1085-2-NDL; DIGI-KEY_PART_NUMBER_4: 576-1085-6-ND; MANUFACTURER_PART_NUMBER: MIC2514YM5-TR; MFR_NAME: Microchip
U17 = Artemis:MAX16998AAUA+T; BUILT_BY: EMA_UL_Team; MANUFACTURER_PART_NUMBER: MAX16998AAUA+T; REVISION: 2; SOURCELIBRARY: Maxim_2014-04-30_1; VENDOR: Maxim Integrated Products
U23 = Artemis:BC848ALT1G; BUILT_BY: EMA_Jessica; COPYRIGHT: Copyright (C) 2018 Accelerated Designs. All rights reserved; MANUFACTURER_PART_NUMBER: BC848ALT1G; SOURCELIBRARY: OnSemi_2021-05-28_3; VENDOR: ON Semiconductor
U25 = Artemis:SI4835DDY-T1-GE3; COPYRIGHT: Copyright (C) 2021 Ultra Librarian. All rights reserved.; MANUFACTURER_PART_NUMBER: SI4835DDY-T1-GE3; MFR_NAME: Vishay
U26 U27 = Artemis:SI3493DDV-T1-GE3; COPYRIGHT: Copyright (C) 2021 Ultra Librarian. All rights reserved.; DIGI-KEY_PART_NUMBER_1: SI3493DDV-T1-GE3TR-ND; DIGI-KEY_PART_NUMBER_2: SI3493DDV-T1-GE3CT-ND; DIGI-KEY_PART_NUMBER_3: SI3493DDV-T1-GE3DKR-ND; MANUFACTURER_PART_NUMBER: SI3493DDV-T1-GE3; MFR_NAME: Vishay
U$1 = Artemis v2 board:V2_BOARD_60PIN
Y1 = Artemis:ABS07-32.768KHZ-T: ABS07 Series 32.768 kHz ±20 ppm 12.5 pF -40 to +85 °C SMT Low Profile Crystal; DESCRIPTION: 32.768kHz ±20ppm Crystal 12.5pF 70 kOhms 2-SMD, No Lead; DIGI-KEY_PART_NUMBER: 535-9542-1-ND; MF: Abracon; MP: ABS07-32.768KHZ-T; PACKAGE: SMD-2 Abracon LLC; PURCHASE-URL: https://pricing.snapeda.com/search/part/ABS07-32.768KHZ-T/?ref=eda

## Board
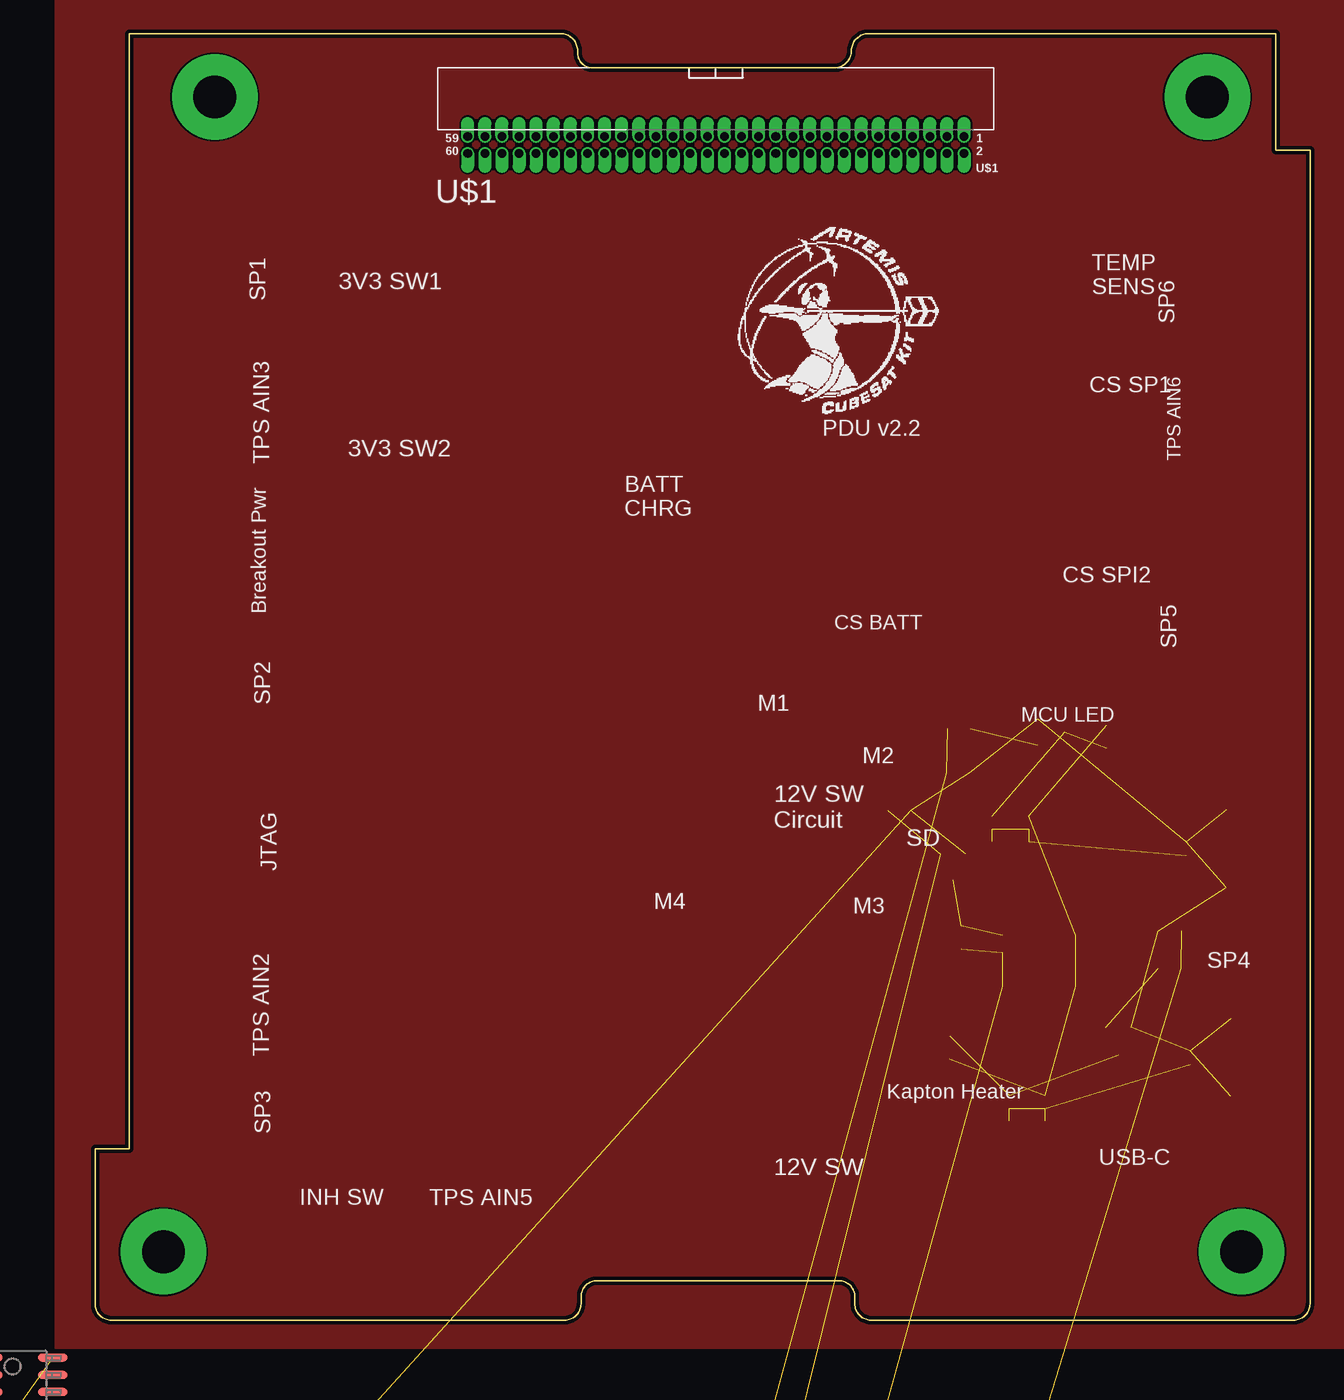
[diagram p8: board, top side]
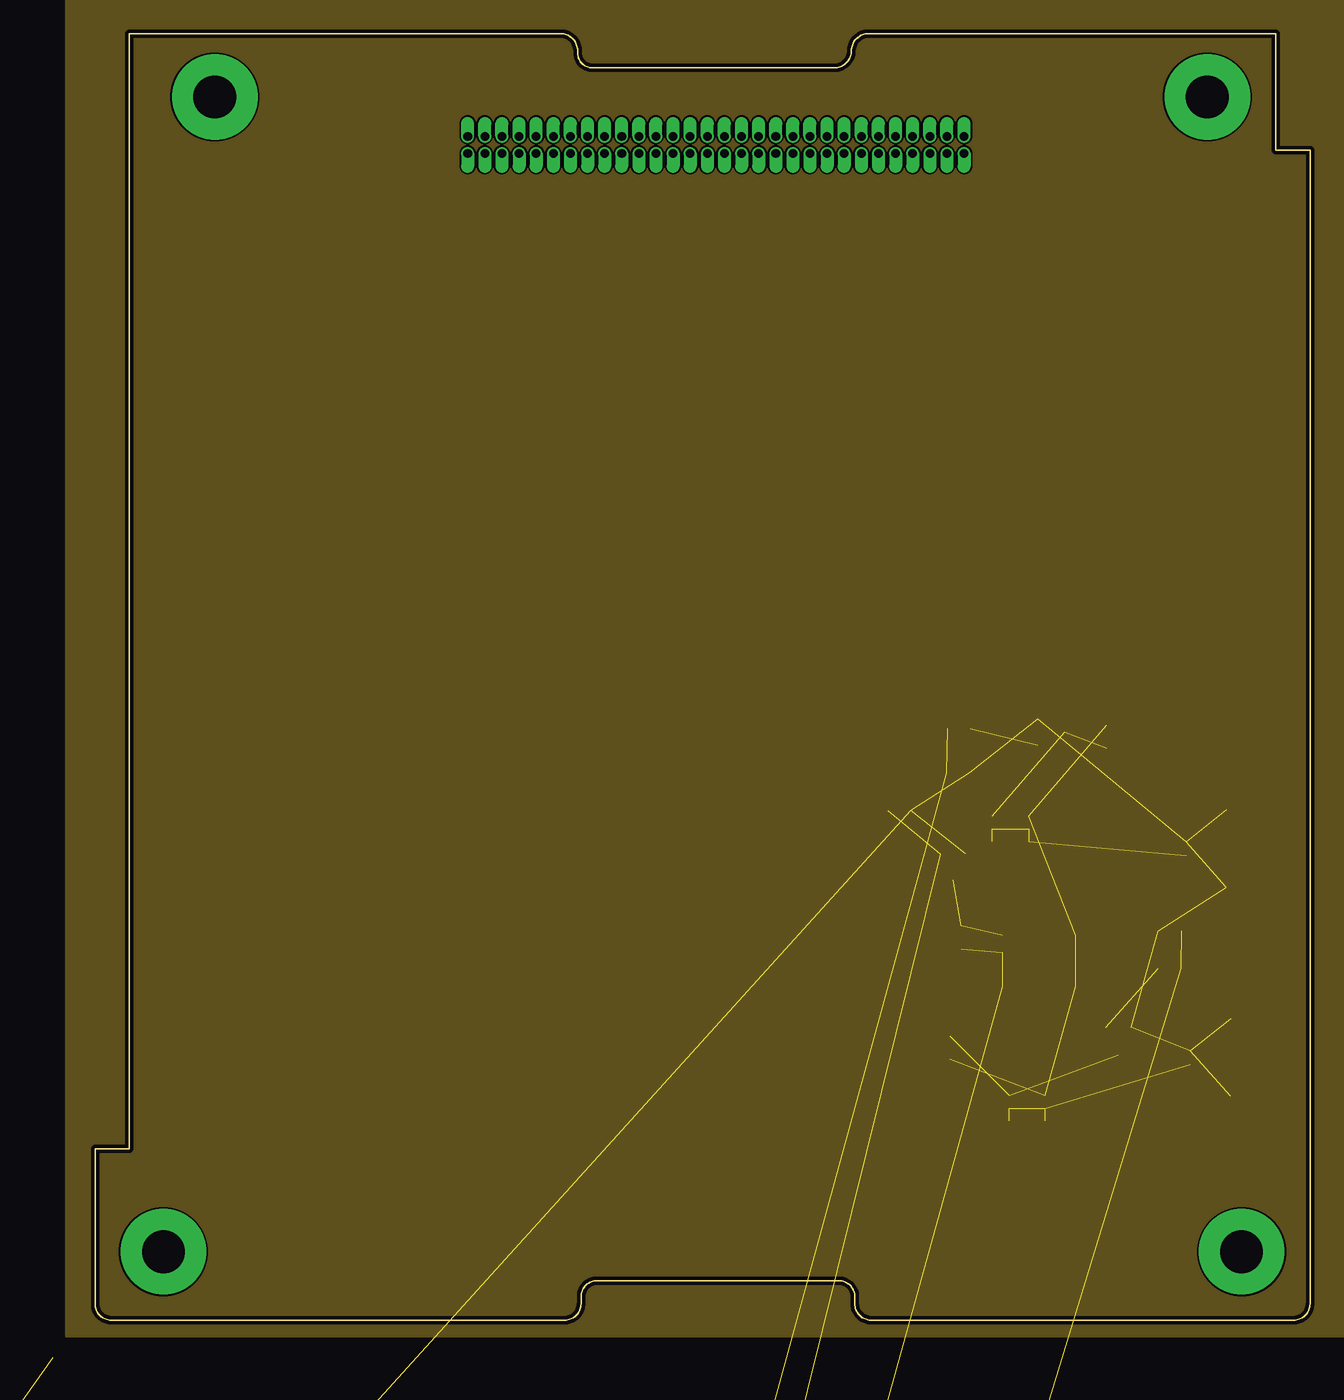
[diagram p9: board, inner layer Route2]
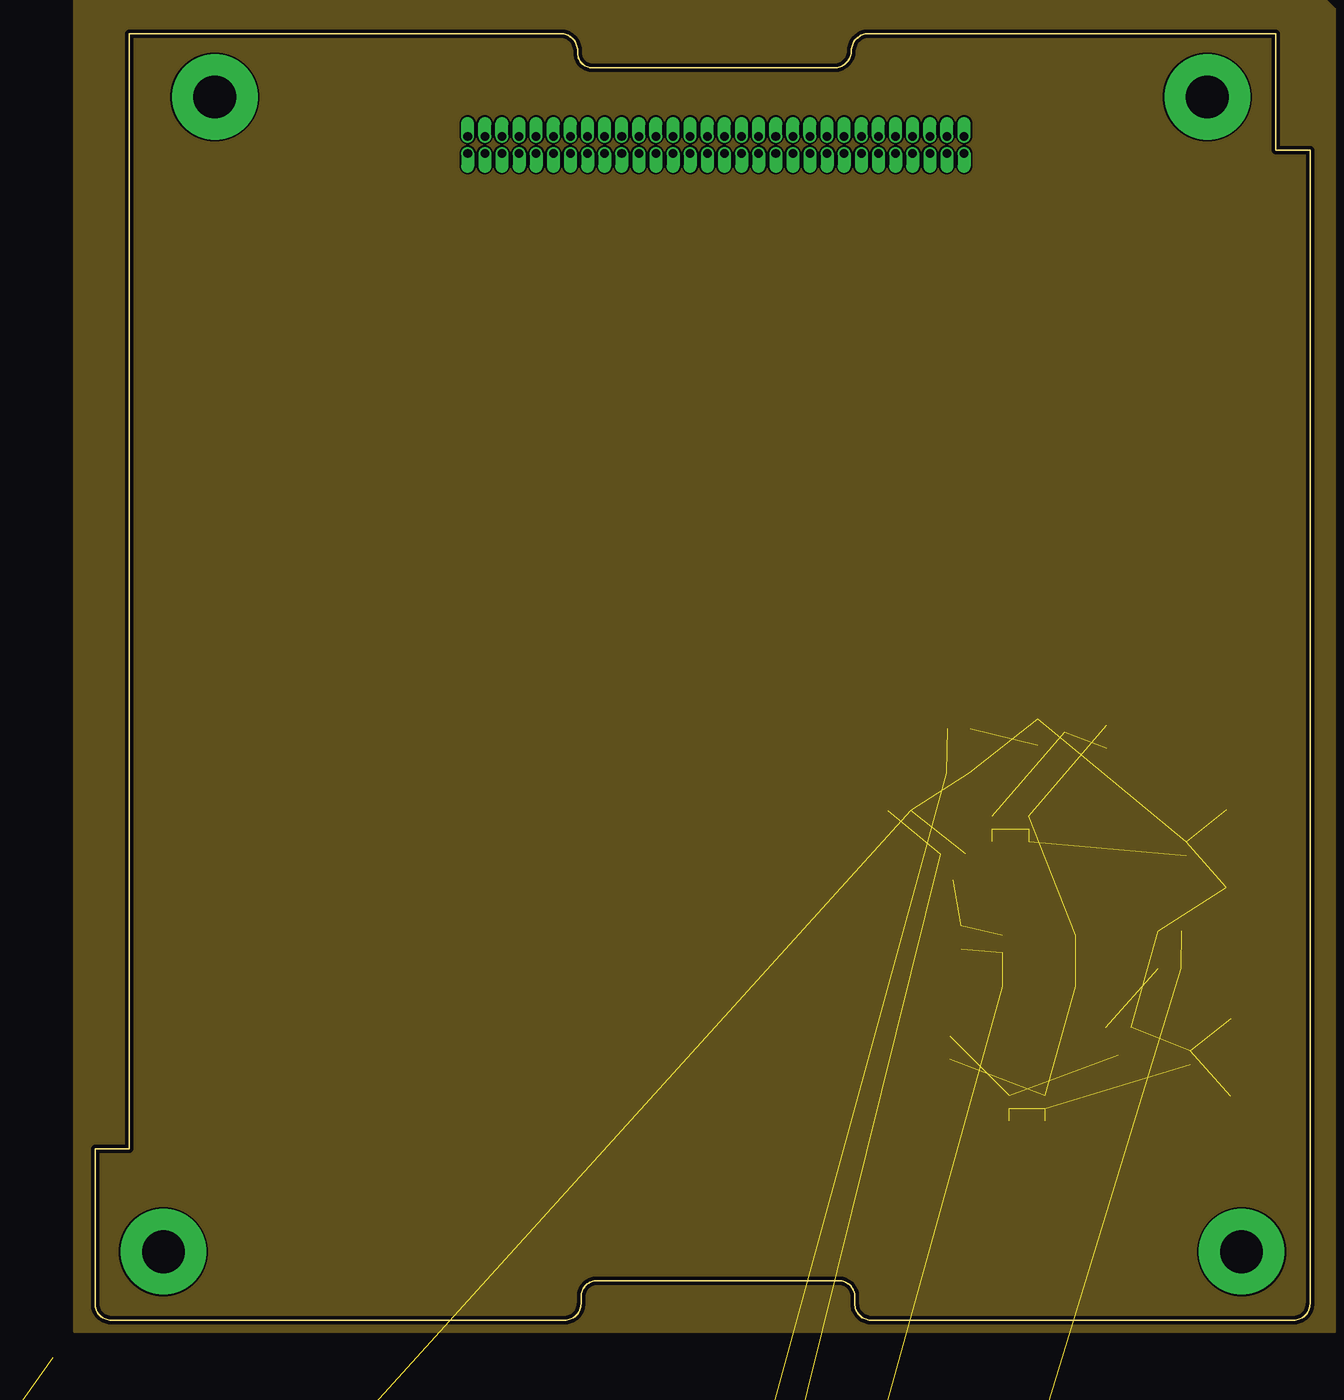
[diagram p10: board, inner layer Route15]
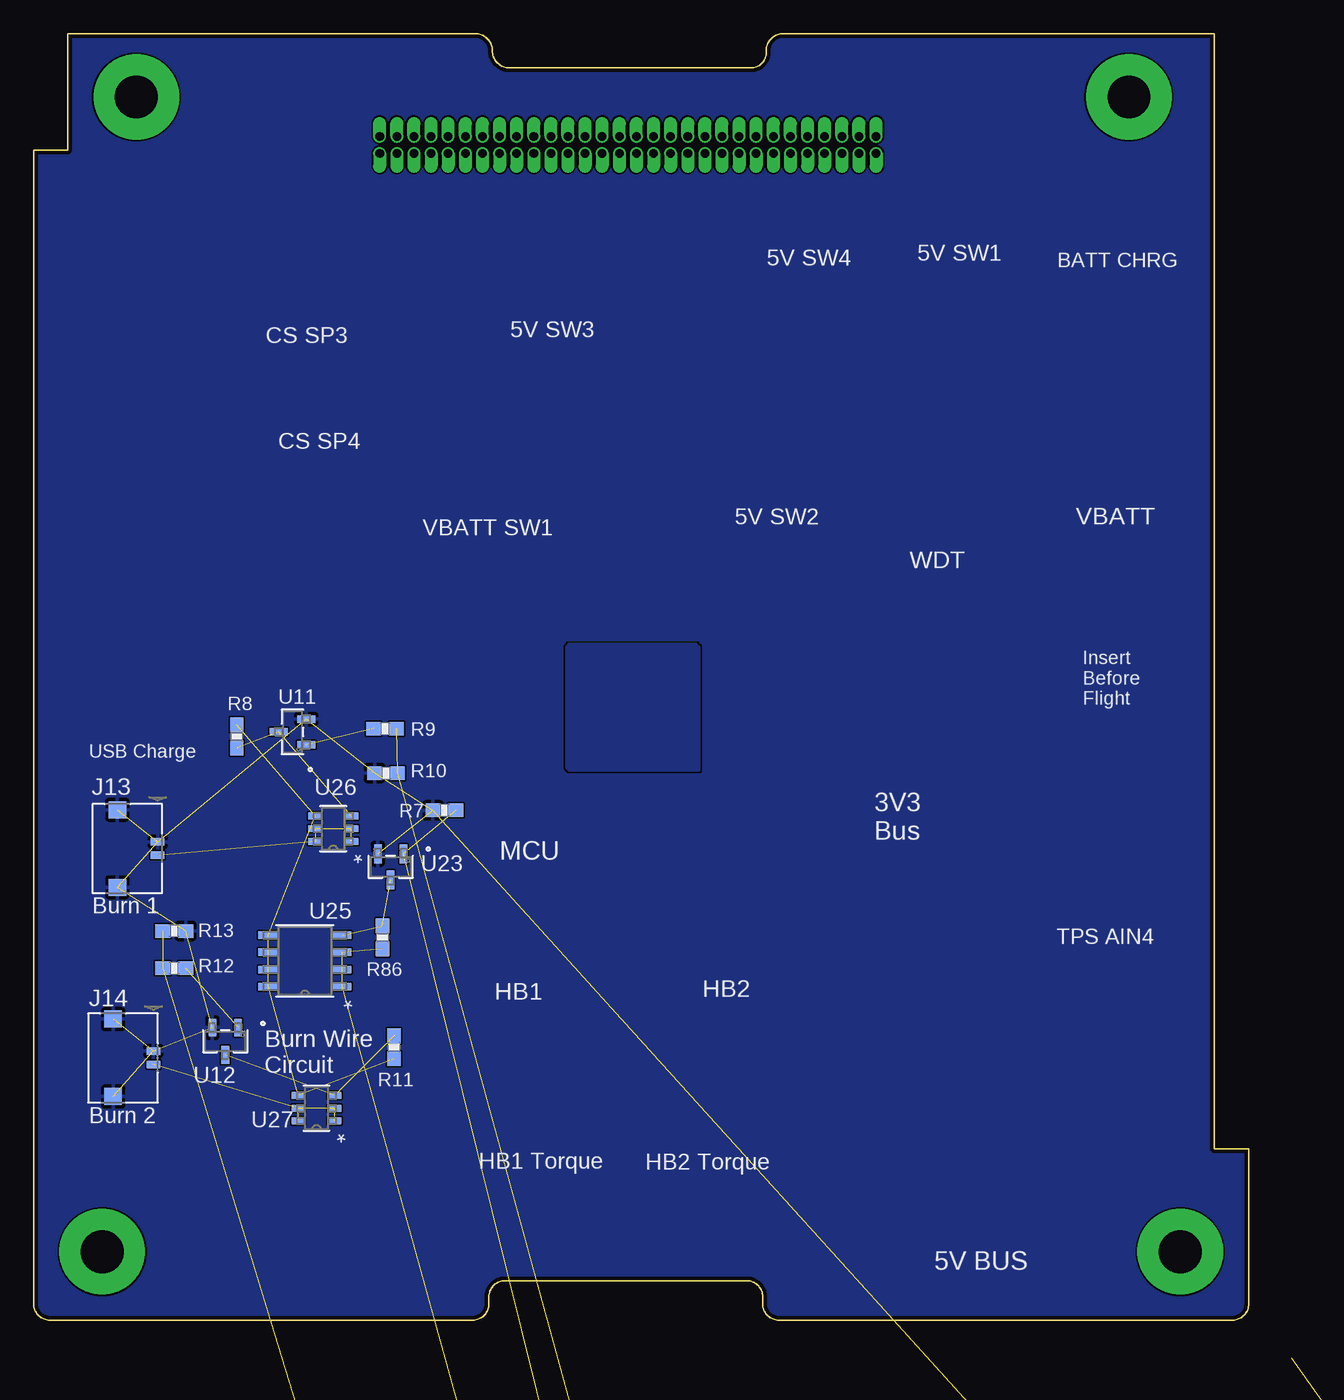
[diagram p11: board, bottom side, seen from below]

Size 90.17 x 95.5 mm. Coordinates in mm from the lower left corner, seen from the top.
Copper layers (1+2*15+16): Top 0.035mm / dielectric 1.5mm / Route2 0.035mm / dielectric 0.15mm / Route15 0.035mm / dielectric 0.2mm / Bottom 0.035mm
Design rules "default *": minimum track width 6mil, minimum drill 5mil, track to track 5mil, track to pad 5mil, pad to pad 5mil, via to via 5mil, smd to smd 5mil, copper to edge 10mil, drill to drill 5mil, minimum pad ring 1mil, minimum via ring 1mil, stop-mask expansion 0mil, vias tented up to drill 0mil, thermal gap 10mil

### Footprints (pad centres in the part's own frame; a part is rotated, then mirrored left to right if it is on the bottom)
0805 = smd 0.8 x 1.2: 1 -0.9,0; 2 0.9,0
1210 = smd 1.2 x 2: 1 -1.6,0; 2 1.6,0
0603-CAP = smd 1.1 x 1: 1 -0.85,0; 2 0.85,0
1206 = smd 1.6 x 1.8: 1 -1.4,0; 2 1.4,0
LED_1655 = smd 1.5 x 1: 1 -2.45,1.6; 2 -2.45,-1.6; 3 2.45,-1.6; 4 2.45,1.6
SOD-123FL = smd 0.91 x 1.22: A 1.637,0; C -1.637,0
CON_5037630491 = smd 0.55 x 1: 1 0,0; 2 -1,0; 3 -2,0; 4 -3,0 | smd 1.26 x 1.3: 5 2.375,2.99; 6 -5.38,2.99
CON_5037630291 = smd 0.55 x 1: 1 0,0; 2 -1,0 | smd 1.26 x 1.3: 3 2.375,2.99; 4 -3.38,2.99
IND_222NLT_PUL = smd 1.956 x 2.997: 1 -2.825,0; 2 2.825,0
INDC2012X100N = smd 1.14 x 1.47: 1 -0.89,0; 2 0.89,0
7443551600 = smd 5 x 4.5: P$1 3,2; P$2 3,12.5
BSZ100N06LS3 = smd 0.635 x 0.254: P$1 0.127,0.66; P$2 0.127,1.321; P$3 0.127,2.007; P$4 0.127,2.642; P$5 3.175,2.642; P$6 3.175,1.981; P$7 3.175,1.321; P$8 3.175,0.66 | smd 1.702 x 2.261: P$9 2.032,1.651
0603-RES = smd 1.1 x 1: 1 -0.85,0; 2 0.85,0
LINEAR_TECHNOLOGY_LTC1477CS8_2 = smd 2.5 x 0.7: 1 -2.45,1.905; 2 -2.45,0.635; 3 -2.45,-0.635; 4 -2.45,-1.905; 5 2.45,-1.905; 6 2.45,-0.635; 7 2.45,0.635; 8 2.45,1.905
MSOP-10_MSE = smd 1.397 x 0.279: 1 -2.184,1.001; 2 -2.184,0.5; 3 -2.184,0; 4 -2.184,-0.5; 5 -2.184,-1.001; 6 2.184,-1.001; 7 2.184,-0.5; 8 2.184,0; 9 2.184,0.5; 10 2.184,1.001 | smd 1.93 x 2.159: 11 0,0
D0008A_N = smd 2.2 x 0.6: 1 -2.4,1.905; 2 -2.4,0.635; 3 -2.4,-0.635; 4 -2.4,-1.905; 5 2.4,-1.905; 6 2.4,-0.635; 7 2.4,0.635; 8 2.4,1.905
PG-TO23-3_INF = smd 0.559 x 1.321: 1 -0.953,-1.016; 2 0.953,-1.016; 3 0,1.016
SOP65P640X120-29N = smd 1.48 x 0.41: 1 -2.865,4.225; 2 -2.865,3.575; 3 -2.865,2.925; 4 -2.865,2.275; 5 -2.865,1.625; 6 -2.865,0.975; 7 -2.865,0.325; 8 -2.865,-0.325; 9 -2.865,-0.975; 10 -2.865,-1.625; 11 -2.865,-2.275; 12 -2.865,-2.925; 13 -2.865,-3.575; 14 -2.865,-4.225; 15 2.865,-4.225; 16 2.865,-3.575; 17 2.865,-2.925; 18 2.865,-2.275; 19 2.865,-1.625; 20 2.865,-0.975; 21 2.865,-0.325; 22 2.865,0.325; 23 2.865,0.975; 24 2.865,1.625; 25 2.865,2.275; 26 2.865,2.925; 27 2.865,3.575; 28 2.865,4.225 | smd 2.74 x 4.75: 29 0,0
TQFP100_14X14MC_MCH = smd 1.473 x 0.279: 1 -7.62,6; 2 -7.62,5.5; 3 -7.62,5; 4 -7.62,4.5; 5 -7.62,4; 6 -7.62,3.5; 7 -7.62,3; 8 -7.62,2.5; 9 -7.62,2; 10 -7.62,1.5; 11 -7.62,1; 12 -7.62,0.5; 13 -7.62,0; 14 -7.62,-0.5; 15 -7.62,-1; 16 -7.62,-1.5; 17 -7.62,-2; 18 -7.62,-2.5; 19 -7.62,-3; 20 -7.62,-3.5; 21 -7.62,-4; 22 -7.62,-4.5; 23 -7.62,-5; 24 -7.62,-5.5; 25 -7.62,-6; 51 7.62,-6; 52 7.62,-5.5; 53 7.62,-5; 54 7.62,-4.5; 55 7.62,-4; 56 7.62,-3.5; 57 7.62,-3; 58 7.62,-2.5; 59 7.62,-2; 60 7.62,-1.5; 61 7.62,-1; 62 7.62,-0.5; 63 7.62,0; 64 7.62,0.5; 65 7.62,1; 66 7.62,1.5; 67 7.62,2; 68 7.62,2.5; 69 7.62,3; 70 7.62,3.5; 71 7.62,4; 72 7.62,4.5; 73 7.62,5; 74 7.62,5.5; 75 7.62,6 | smd 0.279 x 1.473: 26 -6,-7.62; 27 -5.5,-7.62; 28 -5,-7.62; 29 -4.5,-7.62; 30 -4,-7.62; 31 -3.5,-7.62; 32 -3,-7.62; 33 -2.5,-7.62; 34 -2,-7.62; 35 -1.5,-7.62; 36 -1,-7.62; 37 -0.5,-7.62; 38 0,-7.62; 39 0.5,-7.62; 40 1,-7.62; 41 1.5,-7.62; 42 2,-7.62; 43 2.5,-7.62; 44 3,-7.62; 45 3.5,-7.62; 46 4,-7.62; 47 4.5,-7.62; 48 5,-7.62; 49 5.5,-7.62; 50 6,-7.62; 76 6,7.62; 77 5.5,7.62; 78 5,7.62; 79 4.5,7.62; 80 4,7.62; 81 3.5,7.62; 82 3,7.62; 83 2.5,7.62; 84 2,7.62; 85 1.5,7.62; 86 1,7.62; 87 0.5,7.62; 88 0,7.62; 89 -0.5,7.62; 90 -1,7.62; 91 -1.5,7.62; 92 -2,7.62; 93 -2.5,7.62; 94 -3,7.62; 95 -3.5,7.62; 96 -4,7.62; 97 -4.5,7.62; 98 -5,7.62; 99 -5.5,7.62; 100 -6,7.62
SOP65P640X120-17N = smd 1.57 x 0.41: 1 -2.87,2.275; 2 -2.87,1.625; 3 -2.87,0.975; 4 -2.87,0.325; 5 -2.87,-0.325; 6 -2.87,-0.975; 7 -2.87,-1.625; 8 -2.87,-2.275; 9 2.87,-2.275; 10 2.87,-1.625; 11 2.87,-0.975; 12 2.87,-0.325; 13 2.87,0.325; 14 2.87,0.975; 15 2.87,1.625; 16 2.87,2.275 | smd 2.48 x 3.4: 17 0,0
SOT-23-5_M5_MCH = smd 0.978 x 0.508: 1 -1.365,0.95; 2 -1.365,0; 3 -1.365,-0.95; 4 1.365,-0.95; 5 1.365,0.95
21-0036K_MXM = smd 1.321 x 0.406: 1 -2.21,0.975; 2 -2.21,0.325; 3 -2.21,-0.325; 4 -2.21,-0.975; 5 2.21,-0.975; 6 2.21,-0.325; 7 2.21,0.325; 8 2.21,0.975
SOT-23_ONS = smd 0.559 x 1.422: 1 -0.953,-0.965; 2 0.953,-0.965; 3 0,0.965
SOIC_DY-T1-GE3_VIS = smd 1.46 x 0.559: 1 -2.724,1.905; 2 -2.724,0.635; 3 -2.724,-0.635; 4 -2.724,-1.905; 5 2.724,-1.905; 6 2.724,-0.635; 7 2.724,0.635; 8 2.724,1.905
6TSOP_VIS = smd 0.991 x 0.508: 1 -1.346,0.95; 2 -1.346,0; 3 -1.346,-0.95; 4 1.346,-0.95; 5 1.346,0; 6 1.346,0.95
PC104_WCONN_BACKPLANE_HEADER = drill 0.635 pad 0.965 offset: 1 64.489,87.884; 2 64.489,86.614; 3 63.219,87.884; 4 63.219,86.614; 5 61.949,87.884; 6 61.949,86.614; 7 60.679,87.884; 8 60.679,86.614; 9 59.409,87.884; 10 59.409,86.614; 11 58.139,87.884; 12 58.139,86.614; 13 56.869,87.884; 14 56.869,86.614; 15 55.599,87.884; 16 55.599,86.614; 17 54.329,87.884; 18 54.329,86.614; 19 53.059,87.884; 20 53.059,86.614; 21 51.789,87.884; 22 51.789,86.614; 23 50.519,87.884; 24 50.519,86.614; 25 49.249,87.884; 26 49.249,86.614; 27 47.979,87.884; 28 47.979,86.614; 29 46.709,87.884; 30 46.709,86.614; 31 45.439,87.884; 32 45.439,86.614; 33 44.169,87.884; 34 44.169,86.614; 35 42.899,87.884; 36 42.899,86.614; 37 41.629,87.884; 38 41.629,86.614; 39 40.359,87.884; 40 40.359,86.614; 41 39.089,87.884; 42 39.089,86.614; 43 37.819,87.884; 44 37.819,86.614; 45 36.549,87.884; 46 36.549,86.614; 47 35.279,87.884; 48 35.279,86.614; 49 34.009,87.884; 50 34.009,86.614; 51 32.739,87.884; 52 32.739,86.614; 53 31.469,87.884; 54 31.469,86.614; 55 30.199,87.884; 56 30.199,86.614; 57 28.929,87.884; 58 28.929,86.614; 59 27.659,87.884; 60 27.659,86.614 | drill 3.175 pad 6.35: P$1 5.08,5.08; P$2 85.09,5.08; P$3 82.55,90.805; P$4 8.89,90.805
XTAL_ABS07-32.768KHZ-T = smd 1.1 x 1.9: 1 -1.25,0; 2 1.25,0

### Placement (x,y rotation side)
C1  6.96,-143.46 0 top  (outside the outline)
C2  11.12,-143.46 0 top  (outside the outline)
C3  15.27,-143.46 0 top  (outside the outline)
C4  19.42,-143.46 0 top  (outside the outline)
C5  -1.77,-178.1 0 top  (outside the outline)
C6  31.74,-91.86 0 top  (outside the outline)
C7  35.9,-91.86 0 top  (outside the outline)
C8  -7.05,-9.54 0 top  (outside the outline)
C9  40.05,-91.86 0 top  (outside the outline)
C10  -7.05,-32.36 0 top  (outside the outline)
C11  -7.05,-101.82 0 top  (outside the outline)
C12  -2.9,-32.36 0 top  (outside the outline)
C13  -2.9,-101.82 0 top  (outside the outline)
C14  1.25,-32.36 0 top  (outside the outline)
C15  1.25,-101.82 0 top  (outside the outline)
C16  23.58,-143.46 0 top  (outside the outline)
C17  27.73,-143.46 0 top  (outside the outline)
C18  5.41,-32.36 0 top  (outside the outline)
C19  5.41,-101.82 0 top  (outside the outline)
C20  2.38,-178.1 0 top  (outside the outline)
C21  6.54,-178.1 0 top  (outside the outline)
C22  10.69,-178.1 0 top  (outside the outline)
C23  14.84,-178.1 0 top  (outside the outline)
C24  12.58,-171.52 0 top  (outside the outline)
C31  -7.05,-184.16 0 top  (outside the outline)
C32  -2.9,-184.16 0 top  (outside the outline)
C33  1.25,-184.16 0 top  (outside the outline)
C34  5.41,-184.16 0 top  (outside the outline)
C35  9.56,-184.16 0 top  (outside the outline)
C36  -6.7,-178.83 0 top  (outside the outline)
C43  31.88,-143.46 0 top  (outside the outline)
C44  -7.05,-148.91 0 top  (outside the outline)
C45  -2.9,-148.91 0 top  (outside the outline)
C46  1.25,-148.91 0 top  (outside the outline)
C47  5.41,-148.91 0 top  (outside the outline)
C48  9.56,-148.91 0 top  (outside the outline)
C49  13.71,-148.91 0 top  (outside the outline)
C50  -2.31,-143.46 0 top  (outside the outline)
C51  17.87,-148.91 0 top  (outside the outline)
C52  2.48,-143.46 0 top  (outside the outline)
C53  22.02,-148.91 0 top  (outside the outline)
C54  12.58,-234.89 0 top  (outside the outline)
C55  16.07,-234.89 0 top  (outside the outline)
C56  19.56,-234.89 0 top  (outside the outline)
C57  -7.56,-239.75 0 top  (outside the outline)
C58  -4.07,-239.75 0 top  (outside the outline)
C59  -0.57,-239.75 0 top  (outside the outline)
C60  2.92,-239.75 0 top  (outside the outline)
C62  6.41,-239.75 0 top  (outside the outline)
C63  9.9,-239.75 0 top  (outside the outline)
C64  13.4,-239.75 0 top  (outside the outline)
C65  9.56,-101.82 0 top  (outside the outline)
C66  13.71,-101.82 0 top  (outside the outline)
C67  17.87,-101.82 0 top  (outside the outline)
C72  11.06,-228.97 0 top  (outside the outline)
C73  15.22,-228.97 0 top  (outside the outline)
C74  18.15,-131.1 0 top  (outside the outline)
C75  23.84,-131.1 0 top  (outside the outline)
C76  29.52,-131.1 0 top  (outside the outline)
C77  -6.42,-138.42 0 top  (outside the outline)
C78  -0.73,-138.42 0 top  (outside the outline)
C79  4.96,-138.42 0 top  (outside the outline)
C80  10.65,-138.42 0 top  (outside the outline)
C81  16.34,-138.42 0 top  (outside the outline)
C83  22.02,-101.82 0 top  (outside the outline)
C84  26.17,-148.91 0 top  (outside the outline)
C85  12.58,-131.09 0 top  (outside the outline)
C86  30.32,-148.91 0 top  (outside the outline)
C87  -7.05,-153.76 0 top  (outside the outline)
C88  -2.9,-153.76 0 top  (outside the outline)
C89  26.17,-101.82 0 top  (outside the outline)
C90  30.32,-101.82 0 top  (outside the outline)
C99  13.71,-184.16 0 top  (outside the outline)
C100  17.87,-184.16 0 top  (outside the outline)
D2  16.95,-205.77 0 top  (outside the outline)
D4  32.05,-157.95 0 top  (outside the outline)
J1  -3.23,-20.32 0 top  (outside the outline)
J2  8.32,-20.32 0 top  (outside the outline)
J10  26.16,-117.45 0 top  (outside the outline)
J13  80.97,35.51 90 bottom
J14  81.28,19.97 90 bottom
L1  -1.92,-164.88 0 top  (outside the outline)
L3  -1.92,-172.19 0 top  (outside the outline)
L4  17.33,-239.52 0 top  (outside the outline)
L5  -5.27,-127.1 0 top  (outside the outline)
L6  -1.92,-131.77 0 top  (outside the outline)
M1  20.25,-139.86 0 top  (outside the outline)
M2  24.99,-139.86 0 top  (outside the outline)
M3  29.73,-139.86 0 top  (outside the outline)
M4  -8.19,-145.65 0 top  (outside the outline)
R1  1.25,-153.76 0 top  (outside the outline)
R2  5.41,-153.76 0 top  (outside the outline)
R3  9.56,-153.76 0 top  (outside the outline)
R4  13.71,-153.76 0 top  (outside the outline)
R5  17.87,-153.76 0 top  (outside the outline)
R6  22.02,-153.76 0 top  (outside the outline)
R7  59.69,37.85 0 bottom
R8  75.1,43.32 90 bottom
R9  64.1,43.9 0 bottom
R10  64.03,40.61 180 bottom
R11  63.42,20.26 270 bottom
R12  79.74,26.12 180 bottom
R13  79.75,28.89 0 bottom
R14  -7.05,-189.02 0 top  (outside the outline)
R15  -2.9,-189.02 0 top  (outside the outline)
R16  1.25,-189.02 0 top  (outside the outline)
R17  5.41,-189.02 0 top  (outside the outline)
R22  9.56,-189.02 0 top  (outside the outline)
R23  13.71,-189.02 0 top  (outside the outline)
R24  17.87,-189.02 0 top  (outside the outline)
R25  -7.05,-193.87 0 top  (outside the outline)
R26  9.56,-32.36 0 top  (outside the outline)
R27  -7.05,-37.21 0 top  (outside the outline)
R28  -2.9,-37.21 0 top  (outside the outline)
R29  1.25,-37.21 0 top  (outside the outline)
R30  26.17,-153.76 0 top  (outside the outline)
R31  30.32,-153.76 0 top  (outside the outline)
R32  -7.05,-158.62 0 top  (outside the outline)
R33  -2.9,-158.62 0 top  (outside the outline)
R34  5.41,-37.21 0 top  (outside the outline)
R35  9.56,-37.21 0 top  (outside the outline)
R38  9.3,-234.95 0 top  (outside the outline)
R40  -2.9,-193.87 0 top  (outside the outline)
R41  1.25,-193.87 0 top  (outside the outline)
R45  5.41,-193.87 0 top  (outside the outline)
R46  1.25,-158.62 0 top  (outside the outline)
R47  5.41,-158.62 0 top  (outside the outline)
R50  9.56,-193.87 0 top  (outside the outline)
R51  19.37,-228.97 0 top  (outside the outline)
R57  -7.05,-235.12 0 top  (outside the outline)
R58  -2.9,-235.12 0 top  (outside the outline)
R59  1.25,-235.12 0 top  (outside the outline)
R60  5.41,-235.12 0 top  (outside the outline)
R68  9.56,-158.62 0 top  (outside the outline)
R69  13.71,-158.62 0 top  (outside the outline)
R70  17.87,-158.62 0 top  (outside the outline)
R71  22.02,-158.62 0 top  (outside the outline)
R86  64.29,28.41 270 bottom
U3  -3.63,-42.92 0 top  (outside the outline)
U4  -3.63,-52.87 0 top  (outside the outline)
U5  -3.63,-62.83 0 top  (outside the outline)
U6  -3.63,-72.79 0 top  (outside the outline)
U7  -3.63,-82.75 0 top  (outside the outline)
U8  26.87,-159.09 0 top  (outside the outline)
U9  -3.63,-92.71 0 top  (outside the outline)
U10  -5.55,-4.7 0 top  (outside the outline)
U11  70.96,43.66 90 bottom
U12  75.95,20.7 180 bottom
U13  9.33,-116.33 0 top  (outside the outline)
U14  0.75,-209.82 0 top  (outside the outline)
U15  -4.94,-25.78 0 top  (outside the outline)
U16  -5.55,-107.57 0 top  (outside the outline)
U17  -4.28,-221.77 0 top  (outside the outline)
U18  6.66,-25.78 0 top  (outside the outline)
U21  14.41,-194.34 0 top  (outside the outline)
U22  -6.35,-199.19 0 top  (outside the outline)
U23  63.68,33.66 180 bottom
U25  70.05,26.67 180 bottom
U26  67.94,36.48 180 bottom
U27  69.18,15.73 180 bottom
U$1  0,0 0 top
Y1  -6.29,-229.82 0 top  (outside the outline)

### Tracks (layer width: path | path; a pad name or v marks a point on that pad's centre or on a via)
5V_BURN  (2 unrouted)
12V_OUT  (11 unrouted)
12V_SW1  (7 unrouted)
+3V3_VCC  (1 unrouted)
BST_3V3_BUS  (1 unrouted)
BURN1_EN  (2 unrouted)
BURN2_EN  (2 unrouted)
BUS_3V3  (20 unrouted)
BUS_3V3_FB  (3 unrouted)
BUS_3V3_PG  (1 unrouted)
BUS_3V3_TRSS  (1 unrouted)
BUS_3V3_VIN_EN  (2 unrouted)
BUS_5V  (27 unrouted)
BUS_5V_FB  (3 unrouted)
BUS_5V_PG  (1 unrouted)
BUS_5V_TRSS  (1 unrouted)
BUS_5V_VIN_EN  (2 unrouted)
CCO_0  (2 unrouted)
CCO_1  (2 unrouted)
FAULT1  (2 unrouted)
FAULT2  (2 unrouted)
FB_3V3_BUS  (3 unrouted)
GND  (138 unrouted)
  pour Top: -2.84,-2.03 -2.84,99.96 92.95,99.96 93.68,99.24 93.68,-1.37 93.01,-2.03
  pour Route2: -2.18,99.36 -2.18,-1.19 92.86,-1.19 92.86,99.14 -1.96,99.14
  pour Route15: -1.57,98.6 -1.57,-0.86 92.05,-0.86 92.05,97.33 90.78,98.6
  pour Bottom (rank 2): 91.95,98.3 91.95,-0.74 91.74,-0.94 -0.89,-0.94 -0.89,98.04 91.69,98.04
IN1  (1 unrouted)
IN2  (1 unrouted)
IN3  (1 unrouted)
IN4  (1 unrouted)
IN5  (1 unrouted)
IN6  (1 unrouted)
IN7  (1 unrouted)
IN8  (1 unrouted)
LED  (1 unrouted)
N$1  (11 unrouted)
N$2  (1 unrouted)
N$3  (1 unrouted)
N$4  (1 unrouted)
N$6  (1 unrouted)
N$7  (1 unrouted)
N$8  (1 unrouted)
N$11  (1 unrouted)
N$12  (2 unrouted)
N$13  (7 unrouted)
N$14  (1 unrouted)
N$15  (2 unrouted)
N$16  (2 unrouted)
N$17  (1 unrouted)
N$18  (2 unrouted)
N$20  (1 unrouted)
N$25  (1 unrouted)
N$26  (1 unrouted)
N$27  (1 unrouted)
N$28  (1 unrouted)
N$29  (2 unrouted)
N$30  (1 unrouted)
N$31  (1 unrouted)
N$38  (2 unrouted)
N$40  (1 unrouted)
N$41  (10 unrouted)
N$44  (2 unrouted)
N$45  (2 unrouted)
N$46  (1 unrouted)
N$47  (1 unrouted)
N$48  (14 unrouted)
N$49  (1 unrouted)
N$50  (1 unrouted)
N$52  (1 unrouted)
N$55  (1 unrouted)
N$58  (3 unrouted)
N$66  (1 unrouted)
N$68  (1 unrouted)
N$70  (2 unrouted)
PG_3V3_BUS  (1 unrouted)
RESET  (2 unrouted)
RT_3V3_BUS  (1 unrouted)
SLEEP1  (1 unrouted)
SLEEP2  (1 unrouted)
SW_3V3_1  (2 unrouted)
SW_3V3_2  (2 unrouted)
SW_3V3_BUS  (2 unrouted)
SW_3V3_EN1  (1 unrouted)
SW_3V3_EN2  (1 unrouted)
SW_5V_1  (2 unrouted)
SW_5V_2  (2 unrouted)
SW_5V_3  (2 unrouted)
SW_5V_4  (14 unrouted)
SW_5V_EN1  (1 unrouted)
SW_5V_EN2  (1 unrouted)
SW_5V_EN3  (1 unrouted)
SW_5V_EN4  (1 unrouted)
SW_12V_EN1  (3 unrouted)
SW_12V_FB  (2 unrouted)
SW_12V_IN1  (3 unrouted)
SW_12V_PGOOD  (1 unrouted)
SW_VBATT_EN  (1 unrouted)
TORQUE_1A  (1 unrouted)
TORQUE_1B  (1 unrouted)
TORQUE_2A  (1 unrouted)
TORQUE_2B  (1 unrouted)
TORQUE_3A  (1 unrouted)
TORQUE_3B  (1 unrouted)
TORQUE_4A  (1 unrouted)
TORQUE_4B  (1 unrouted)
TRQ1  (1 unrouted)
TRQ2  (1 unrouted)
TRSS_3V3_BUS  (1 unrouted)
V_BATT_SENSE  (1 unrouted)
VBATT  (13 unrouted)
VBURN1  (4 unrouted)
VBURN2  (4 unrouted)
VCC_3V3_BUS  (1 unrouted)
VDD
  pour Bottom: 40.92,40.84 50.39,40.84 50.57,41.02 50.57,49.99 50.39,50.16 41.07,50.16 40.89,49.99 40.84,49.94 40.84,40.87
VDD1  (13 unrouted)
VIN3  (5 unrouted)
WDT_EN  (1 unrouted)
WDT_WDI  (2 unrouted)

### Text on the board
tPlace: Kapton Heater
tNames: 3V3 SW1 | SP1 | TEMP / SENS | SP6 | CS SP1 | PDU v2.2 | TPS AIN3 | 3V3 SW2 | TPS AIN6 | BATT / CHRG | CS SPI2 | Breakout Pwr | CS BATT | SP5 | SP2 | M1 | MCU LED | M2 | 12V SW / Circuit | SD | JTAG | M4 | M3 | SP4 | TPS AIN2 | SP3 | USB-C | 12V SW | INH SW | TPS AIN5
bNames: 5V SW1 | BATT CHRG | 5V SW4 | 5V SW3 | CS SP3 | CS SP4 | VBATT | 5V SW2 | VBATT SW1 | WDT | Insert / Before / Flight | USB Charge | 3V3 / Bus | MCU | Burn 1 | TPS AIN4 | HB2 | HB1 | Burn Wire / Circuit | Burn 2 | HB2 Torque | HB1 Torque | 5V BUS